# Altium project peripheral.PRJPCB
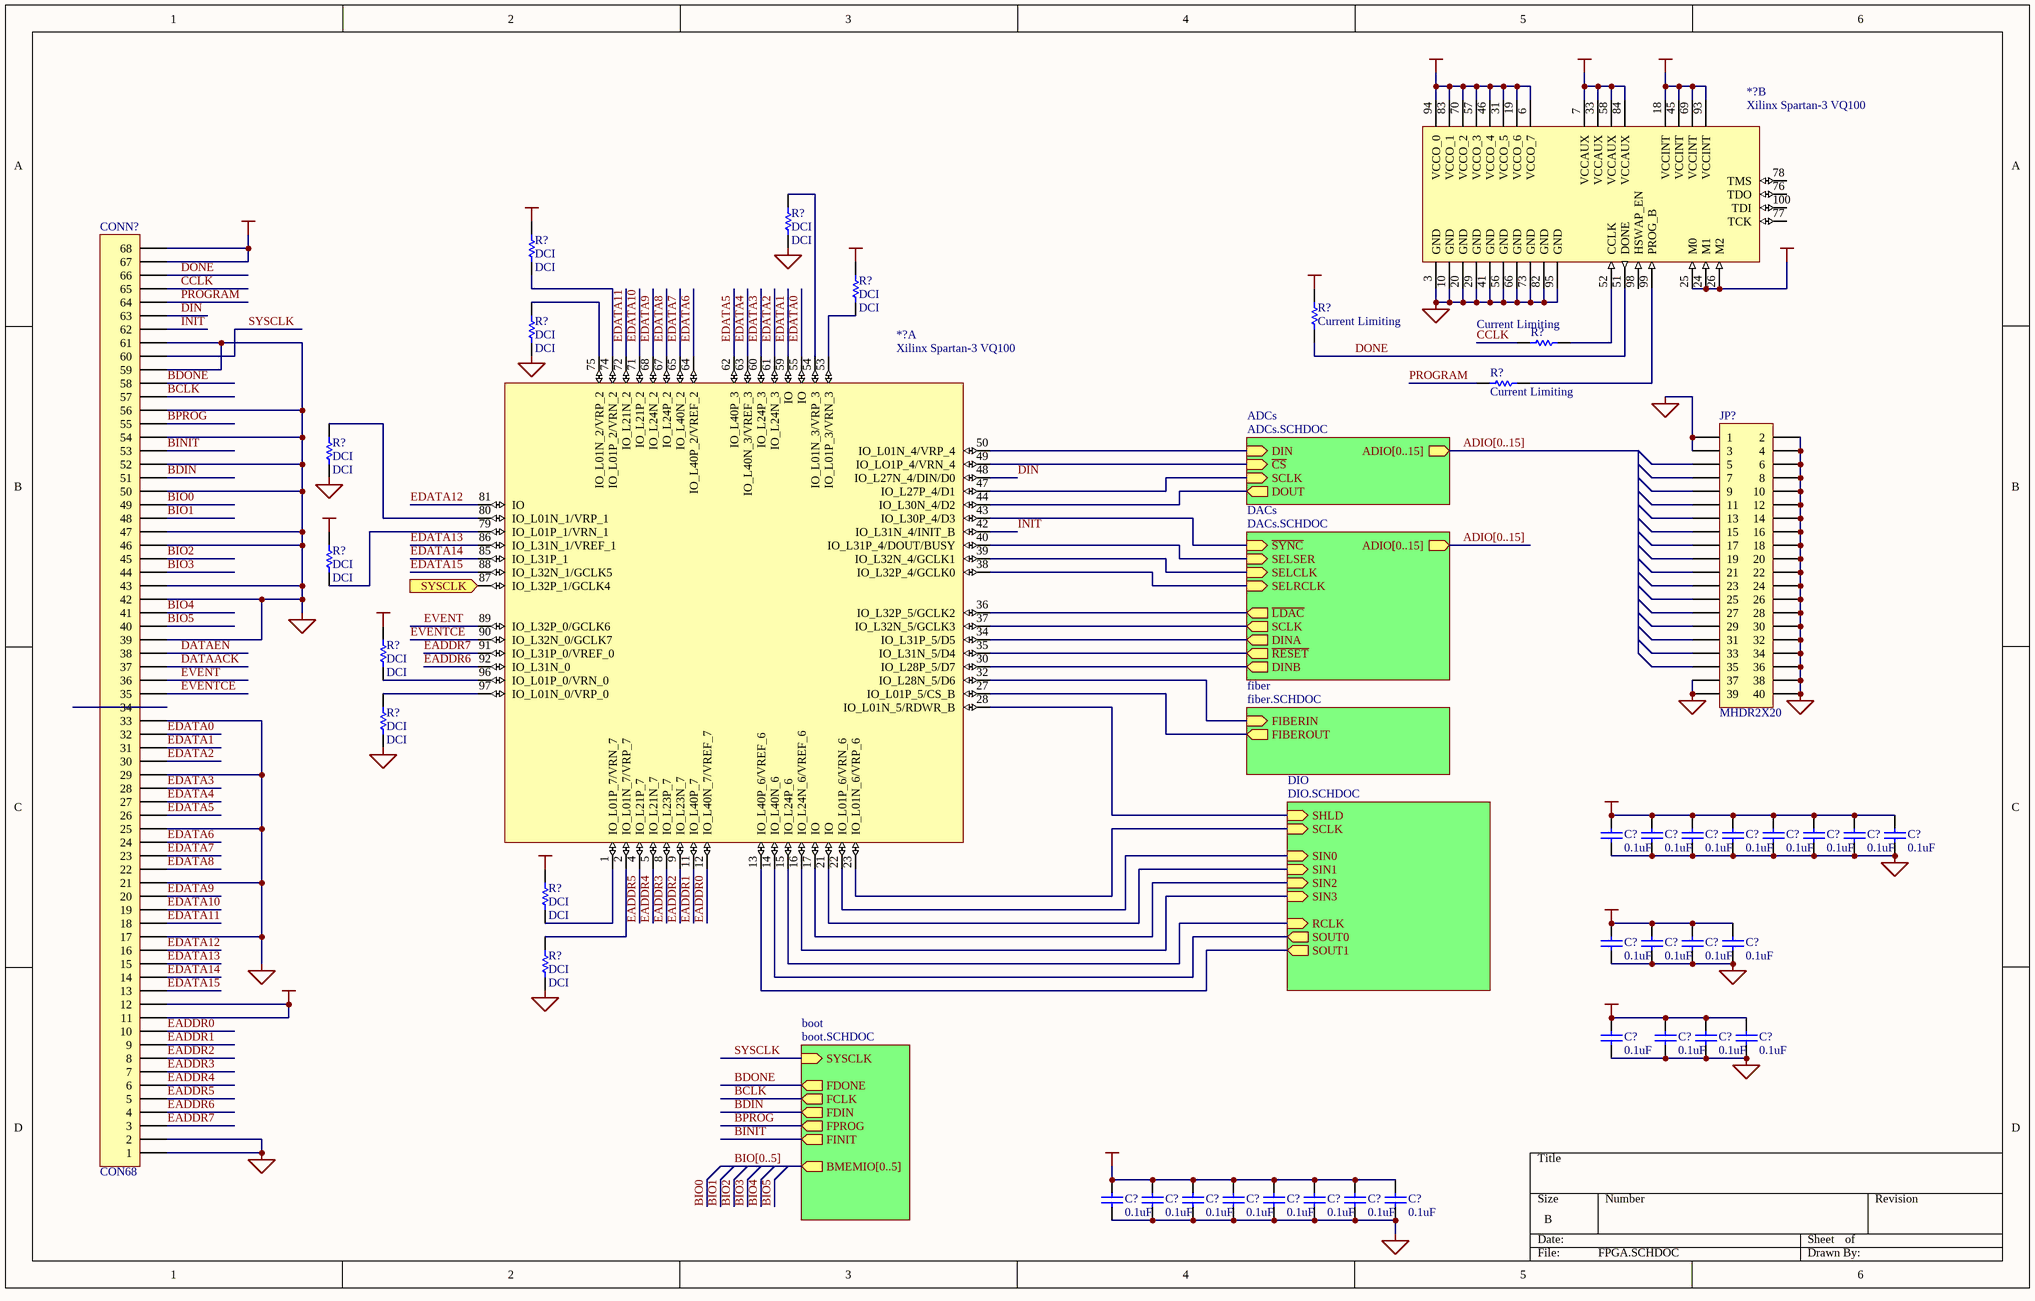
[diagram p0: FPGA.SCHDOC]
6 sheets, 193 parts. Net scope: hierarchical (ports join the sheet entries above them; power ports are global).
Sheets:
  FPGA.SCHDOC
    ADCs = ADCs.SCHDOC
    DIO = DIO.SCHDOC
    DACs = DACs.SCHDOC
    fiber = fiber.SCHDOC
    boot = boot.SCHDOC

## Sheet FPGA.SCHDOC
size B

### Parts
(Parts that share a designator on the sheet are numbered #1, #2 ... from top to bottom, then left to right.)
*?#1  Xilinx Spartan-3 VQ100  [F-QFP14X14-G100/N]  (part B of 2)
*?#2  Xilinx Spartan-3 VQ100  [F-QFP14X14-G100/N]  (part A of 2)
C?#1  value 0.1uF  [CC1608-0603]  (hidden comment: Cap)
C?#2  value 0.1uF  [CC1608-0603]  (hidden comment: Cap)
C?#3  value 0.1uF  [CC1608-0603]  (hidden comment: Cap)
C?#4  value 0.1uF  [CC1608-0603]  (hidden comment: Cap)
C?#5  value 0.1uF  [CC1608-0603]  (hidden comment: Cap)
C?#6  value 0.1uF  [CC1608-0603]  (hidden comment: Cap)
C?#7  value 0.1uF  [CC1608-0603]  (hidden comment: Cap)
C?#8  value 0.1uF  [CC1608-0603]  (hidden comment: Cap)
C?#9  value 0.1uF  [CC1608-0603]  (hidden comment: Cap)
C?#10  value 0.1uF  [CC1608-0603]  (hidden comment: Cap)
C?#11  value 0.1uF  [CC1608-0603]  (hidden comment: Cap)
C?#12  value 0.1uF  [CC1608-0603]  (hidden comment: Cap)
C?#13  value 0.1uF  [CC1608-0603]  (hidden comment: Cap)
C?#14  value 0.1uF  [CC1608-0603]  (hidden comment: Cap)
C?#15  value 0.1uF  [CC1608-0603]  (hidden comment: Cap)
C?#16  value 0.1uF  [CC1608-0603]  (hidden comment: Cap)
C?#17  value 0.1uF  [CC1608-0603]  (hidden comment: Cap)
C?#18  value 0.1uF  [CC1608-0603]  (hidden comment: Cap)
C?#19  value 0.1uF  [CC1608-0603]  (hidden comment: Cap)
C?#20  value 0.1uF  [CC1608-0603]  (hidden comment: Cap)
C?#21  value 0.1uF  [CC1608-0603]  (hidden comment: Cap)
C?#22  value 0.1uF  [CC1608-0603]  (hidden comment: Cap)
C?#23  value 0.1uF  [CC1608-0603]  (hidden comment: Cap)
C?#24  value 0.1uF  [CC1608-0603]  (hidden comment: Cap)
CONN?  CON68  [MOLEX 71661-2068]
JP?  MHDR2X20  [MHDR2X20]
R?#1  DCI  [CC1608-0603]
R?#2  DCI  [CC1608-0603]
R?#3  DCI  [CC1608-0603]
R?#4  Current Limiting  [CC1608-0603]
R?#5  Current Limiting  [CC1608-0603]
R?#6  DCI  [CC1608-0603]
R?#7  Current Limiting  [CC1608-0603]
R?#8  DCI  [CC1608-0603]
R?#9  DCI  [CC1608-0603]
R?#10  DCI  [CC1608-0603]
R?#11  DCI  [CC1608-0603]
R?#12  DCI  [CC1608-0603]
R?#13  DCI  [CC1608-0603]

### Sub-sheets
ADCs = ADCs.SCHDOC: ADIO[0..15] (out), DIN (in), DOUT (out), ~{CS} (in), SCLK (in)
boot = boot.SCHDOC: SYSCLK (in), BMEMIO[0..5] (out), FPROG (out), FDONE (out), FCLK (out), FDIN (out), FINIT (out)
DACs = DACs.SCHDOC: ADIO[0..15] (out), ~{SYNC} (in), ~{LDAC} (out), SCLK (out), DINA (out), ~{RESET} (out), DINB (out), SELSER (in), SELCLK (in), SELRCLK (in)
DIO = DIO.SCHDOC: SOUT0 (out), SOUT1 (out), SHLD (in), SCLK (in), SIN0 (in), SIN1 (in), SIN2 (in), SIN3 (in), RCLK (in)
fiber = fiber.SCHDOC: FIBERIN (in), FIBEROUT (out)

### Ports
SYSCLK (in)

### Nets
+1.2VCC: *?#1.18(VCCINT) *?#1.45(VCCINT) *?#1.69(VCCINT) *?#1.93(VCCINT) C?#9.1 C?#10.1 C?#11.1 C?#12.1
+2.5VCC: *?#1.7(VCCAUX) *?#1.33(VCCAUX) *?#1.58(VCCAUX) *?#1.84(VCCAUX) C?#13.1 C?#14.1 C?#15.1 C?#16.1
+3.3VCC: *?#1.6(VCCO_7) *?#1.19(VCCO_6) *?#1.31(VCCO_5) *?#1.46(VCCO_4) *?#1.57(VCCO_3) *?#1.70(VCCO_2) *?#1.83(VCCO_1) *?#1.94(VCCO_0)
+5VCC: C?#17.2 C?#18.2 C?#19.2 C?#20.2 C?#21.2 C?#22.2 C?#23.2 C?#24.2
GND: *?#1.3(GND) *?#1.10(GND) *?#1.20(GND) *?#1.29(GND) *?#1.41(GND) *?#1.56(GND) *?#1.66(GND) *?#1.73(GND) *?#1.82(GND) *?#1.95(GND) C?#1.2 C?#2.2 C?#3.2 C?#4.2 C?#5.2 C?#6.2 C?#7.2 C?#8.2 C?#9.2 C?#10.2 C?#11.2 C?#12.2 C?#13.2 C?#14.2 C?#15.2 C?#16.2 C?#17.1 C?#18.1 C?#19.1 C?#20.1 C?#21.1 C?#22.1 C?#23.1 C?#24.1 CONN?.1 CONN?.2 CONN?.17 CONN?.21 CONN?.25 CONN?.29 CONN?.33 CONN?.39 CONN?.42 CONN?.43 CONN?.46 CONN?.47 CONN?.50 CONN?.52 CONN?.54 CONN?.56 CONN?.59 CONN?.61 JP?.1 JP?.2 JP?.3 JP?.4 JP?.6 JP?.8 JP?.10 JP?.12 JP?.14 JP?.16 JP?.18 JP?.20 JP?.22 JP?.24 JP?.26 JP?.28 JP?.30 JP?.32 JP?.34 JP?.36 JP?.37 JP?.38 JP?.39 JP?.40 R?#1.1 R?#6.1 R?#8.1 R?#11.1 R?#13.1
VCC: *?#1.24(M1) *?#1.25(M0) *?#1.26(M2) C?#1.1 C?#2.1 C?#3.1 C?#4.1 C?#5.1 C?#6.1 C?#7.1 C?#8.1 CONN?.11 CONN?.12 CONN?.67 CONN?.68 R?#2.2 R?#3.2 R?#4.2 R?#9.2 R?#10.2 R?#12.2
BCLK: CONN?.57 ; sheet boot/FCLK
BDIN: CONN?.51 ; sheet boot/FDIN
BDONE: CONN?.58 ; sheet boot/FDONE
BINIT: CONN?.53 ; sheet boot/FINIT
BIO0: CONN?.49
BIO1: CONN?.48
BIO2: CONN?.45
BIO3: CONN?.44
BIO4: CONN?.41
BIO5: CONN?.40
BPROG: CONN?.55 ; sheet boot/FPROG
CCLK: CONN?.65 R?#5.1
DATAACK: CONN?.37
DATAEN: CONN?.38
DIN: *?#2.48(IO_L27N_4/DIN/D0) CONN?.63
DONE: *?#1.51(DONE) CONN?.66 R?#4.1
EADDR0: *?#2.12(IO_L40N_7/VREF_7) CONN?.10
EADDR1: *?#2.11(IO_L40P_7) CONN?.9
EADDR2: *?#2.9(IO_L23N_7) CONN?.8
EADDR3: *?#2.8(IO_L23P_7) CONN?.7
EADDR4: *?#2.5(IO_L21N_7) CONN?.6
EADDR5: *?#2.4(IO_L21P_7) CONN?.5
EADDR6: *?#2.92(IO_L31N_0) CONN?.4
EADDR7: *?#2.91(IO_L31P_0/VREF_0) CONN?.3
EDATA0: *?#2.55(IO) CONN?.32
EDATA1: *?#2.59(IO) CONN?.31
EDATA2: *?#2.61(IO_L24N_3) CONN?.30
EDATA3: *?#2.60(IO_L24P_3) CONN?.28
EDATA4: *?#2.63(IO_L40N_3/VREF_3) CONN?.27
EDATA5: *?#2.62(IO_L40P_3) CONN?.26
EDATA6: *?#2.64(IO_L40P_2/VREF_2) CONN?.24
EDATA7: *?#2.65(IO_L40N_2) CONN?.23
EDATA8: *?#2.67(IO_L24P_2) CONN?.22
EDATA9: *?#2.68(IO_L24N_2) CONN?.20
EDATA10: *?#2.71(IO_L21P_2) CONN?.19
EDATA11: *?#2.72(IO_L21N_2) CONN?.18
EDATA12: *?#2.81(IO) CONN?.16
EDATA13: *?#2.86(IO_L31N_1/VREF_1) CONN?.15
EDATA14: *?#2.85(IO_L31P_1) CONN?.14
EDATA15: *?#2.88(IO_L32N_1/GCLK5) CONN?.13
EVENT: *?#2.89(IO_L32P_0/GCLK6) CONN?.36
EVENTCE: *?#2.90(IO_L32N_0/GCLK7) CONN?.35
INIT: *?#2.42(IO_L31N_4/INIT_B) CONN?.62
~{LDAC}: *?#2.36(IO_L32P_5/GCLK2) ; sheet DACs/~{LDAC}
~{PROGRAM}: CONN?.64
PROGRAM: R?#7.1
~{RESET}: *?#2.35(IO_L31N_5/D4) ; sheet DACs/~{RESET}
RCLK: *?#2.15(IO_L24P_6) ; sheet DIO/RCLK
~{SYNC}: *?#2.43(IO_L30P_4/D3) ; sheet DACs/~{SYNC}
SCLK: *?#2.37(IO_L32N_5/GCLK3) ; sheet DACs/SCLK
SCLK: *?#2.23(IO_L01N_6/VRP_6) ; sheet DIO/SCLK  [a separate net that carries the same name]
SELCLK: *?#2.39(IO_L32N_4/GCLK1) ; sheet DACs/SELCLK
SELRCLK: *?#2.38(IO_L32P_4/GCLK0) ; sheet DACs/SELRCLK
SELSER: *?#2.40(IO_L31P_4/DOUT/BUSY) ; sheet DACs/SELSER
SHLD: *?#2.28(IO_L01N_5/RDWR_B) ; sheet DIO/SHLD
SYSCLK: CONN?.60 ; sheet boot/SYSCLK
Net*?#1_52: *?#1.52(CCLK) R?#5.2
Net*?#1_99: *?#1.99(PROG_B) R?#7.2
Net*?#2_1: *?#2.1(IO_L01P_7/VRN_7) R?#12.1
Net*?#2_2: *?#2.2(IO_L01N_7/VRP_7) R?#13.2
Net*?#2_13: *?#2.13(IO_L40P_6/VREF_6) ; sheet DIO/SOUT1
Net*?#2_14: *?#2.14(IO_L40N_6) ; sheet DIO/SOUT0
Net*?#2_16: *?#2.16(IO_L24N_6/VREF_6) ; sheet DIO/SIN3
Net*?#2_17: *?#2.17(IO) ; sheet DIO/SIN2
Net*?#2_21: *?#2.21(IO) ; sheet DIO/SIN1
Net*?#2_22: *?#2.22(IO_L01P_6/VRN_6) ; sheet DIO/SIN0
Net*?#2_27: *?#2.27(IO_L01P_5/CS_B) ; sheet fiber/FIBEROUT
Net*?#2_30: *?#2.30(IO_L28P_5/D7) ; sheet DACs/DINB
Net*?#2_32: *?#2.32(IO_L28N_5/D6) ; sheet fiber/FIBERIN
Net*?#2_34: *?#2.34(IO_L31P_5/D5) ; sheet DACs/DINA
Net*?#2_44: *?#2.44(IO_L30N_4/D2) ; sheet ADCs/DOUT
Net*?#2_47: *?#2.47(IO_L27P_4/D1) ; sheet ADCs/SCLK
Net*?#2_49: *?#2.49(IO_LO1P_4/VRN_4) ; sheet ADCs/~{CS}
Net*?#2_50: *?#2.50(IO_L01N_4/VRP_4) ; sheet ADCs/DIN
Net*?#2_53: *?#2.53(IO_L01P_3/VRN_3) R?#3.1
Net*?#2_54: *?#2.54(IO_L01N_3/VRP_3) R?#1.2
Net*?#2_74: *?#2.74(IO_L01P_2/VRN_2) R?#2.1
Net*?#2_75: *?#2.75(IO_L01N_2/VRP_2) R?#6.2
Net*?#2_79: *?#2.79(IO_L01P_1/VRN_1) R?#9.1
Net*?#2_80: *?#2.80(IO_L01N_1/VRP_1) R?#8.2
Net*?#2_87: *?#2.87(IO_L32P_1/GCLK4) ; port SYSCLK
Net*?#2_96: *?#2.96(IO_L01P_0/VRN_0) R?#10.1
Net*?#2_97: *?#2.97(IO_L01N_0/VRP_0) R?#11.2

Not connected (* = marked no-connect by the designer): *?#1 76(TDO) 77(TCK) 78(TMS) 98(HSWAP_EN) 100(TDI); CONN? 34; JP? 5 7 9 11 13 15 17 19 21 23 25 27 29 31 33 35

### Buses and harness runs
bus ADIO[0..15] = sheet ADCs/ADIO[0..15]
bus ADIO[0..15] = sheet DACs/ADIO[0..15]
bus BIO[0..5] = sheet boot/BMEMIO[0..5]

### Library data of the parts
*?#1 *?#2 = XC3S50-VQ100
C?#1-C?#24 = Cap: Capacitor; Manufacturer: Generic Components; Class I: Passive; Published: 8-Jun-2000; Revision: July-2002: Re-released for DXP Platform.; Publisher: Altium Limited; Class II: Capacitor
JP? = MHDR2X20: Header, 20-Pin, Dual row; Manufacturer: Generic Components; Class I: Connector; Revision: July-2002: Re-released for DXP Platform.; Publisher: Altium Limited
R?#1-R?#3 R?#6 R?#8-R?#13 = Res1: Resistor; Manufacturer: Generic Components; Class I: Passive; Published: 8-Jun-2000; Revision: July-2002: Re-released for DXP Platform.; Publisher: Altium Limited; Class II: Resistor; Value: DCI
R?#4 R?#5 R?#7 = Res1: Resistor; Manufacturer: Generic Components; Class I: Passive; Value: 1K; Published: 8-Jun-2000; Revision: July-2002: Re-released for DXP Platform.; Publisher: Altium Limited; Class II: Resistor

## Sheet ADCs.SCHDOC
size B
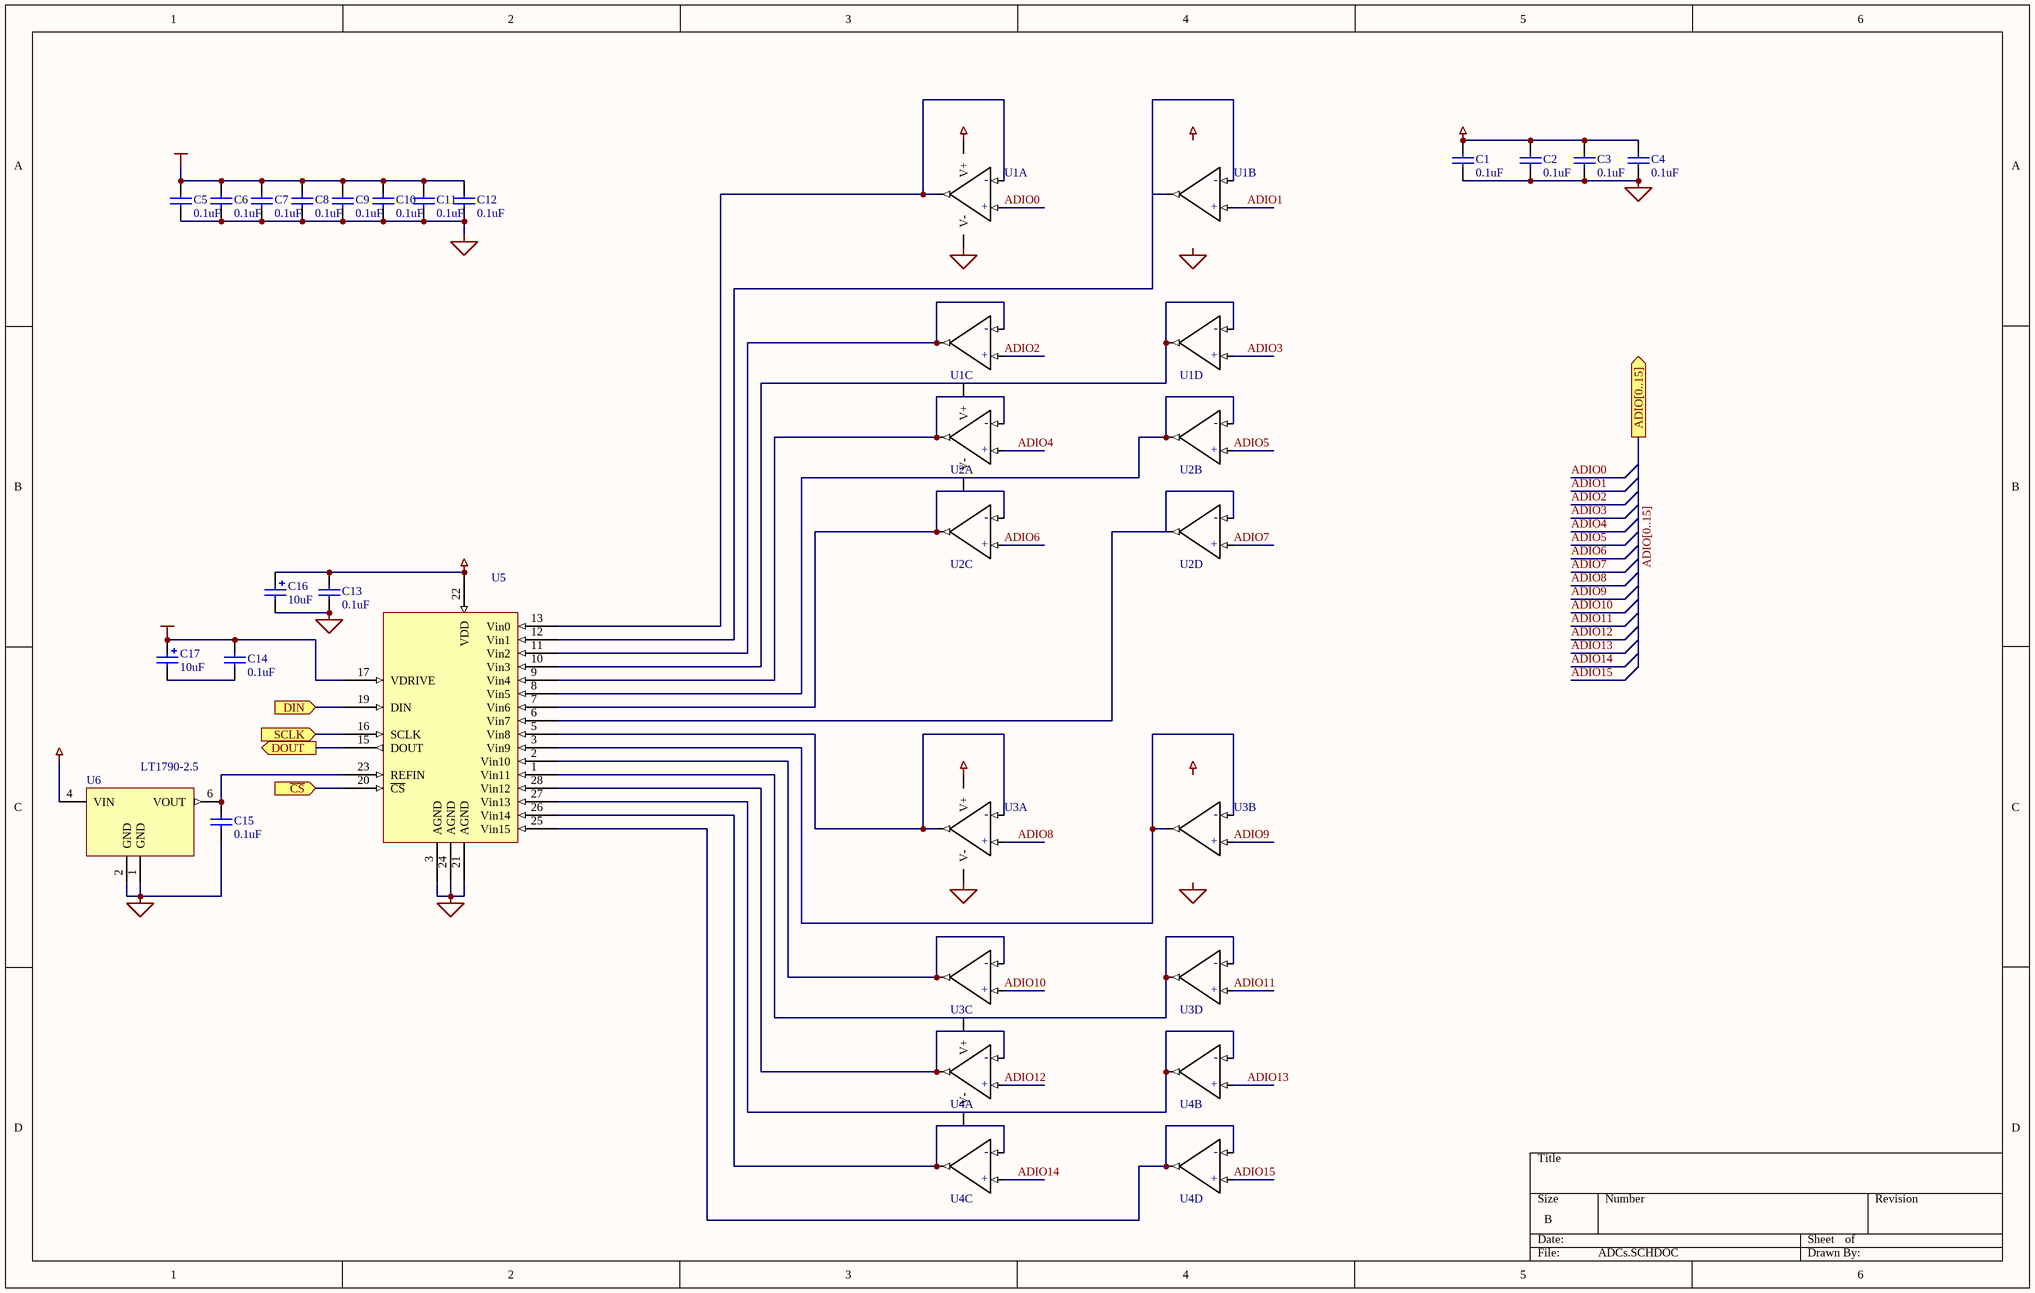
[diagram p1: ADCs.SCHDOC]

### Parts
(Parts that share a designator on the sheet are numbered #1, #2 ... from top to bottom, then left to right.)
C1  value 0.1uF  [CC1608-0603]  (hidden comment: Cap)
C2  value 0.1uF  [CC1608-0603]  (hidden comment: Cap)
C3  value 0.1uF  [CC1608-0603]  (hidden comment: Cap)
C4  value 0.1uF  [CC1608-0603]  (hidden comment: Cap)
C5  value 0.1uF  [CC1608-0603]  (hidden comment: Cap)
C6#1  value 0.1uF  [CC1608-0603]  (hidden comment: Cap)
C7  value 0.1uF  [CC1608-0603]  (hidden comment: Cap)
C8  value 0.1uF  [CC1608-0603]  (hidden comment: Cap)
C9  value 0.1uF  [CC1608-0603]  (hidden comment: Cap)
C10  value 0.1uF  [CC1608-0603]  (hidden comment: Cap)
C11  value 0.1uF  [CC1608-0603]  (hidden comment: Cap)
C12#1  value 0.1uF  [CC1608-0603]  (hidden comment: Cap)
C13#1  value 0.1uF  [CC1608-0603]  (hidden comment: Cap)
C14#1  value 0.1uF  [CC1608-0603]  (hidden comment: Cap)
C15  value 0.1uF  [CC1608-0603]  (hidden comment: Cap)
C16  value 10uF  [TC3528-1411]  (hidden comment: Tantalum)
C17  value 10uF  [TC3528-1411]  (hidden comment: Tantalum)
U1  OP496  [SO-G14]  (value not drawn)  (parts A,B,C,D of 4)
U2#1  OP496  [SO-G14]  (value not drawn)  (parts A,B,C,D of 4)
U3  OP496  [SO-G14]  (value not drawn)  (parts A,B,C,D of 4)
U4#1  OP496  [SO-G14]  (value not drawn)  (parts A,B,C,D of 4)
U5  (no value)  [SSO-G28/X.45]
U6  LT1790-2.5  [LTI SOT-23 ThinSOT]

### Ports
ADIO[0..15] (out), DIN (in), DOUT (out), SCLK (in), ~{CS} (in)

### Nets
+5VCC: C5.2 C6#1.2 C7.2 C8.2 C9.2 C10.2 C11.2 C12#1.2
AVDD: C1.2 C2.2 C3.2 C4.2 C13#1.2 C16.1 U1.4(V+) U3.4(V+) U5.22(VDD) U6.4(VIN)
GND: C1.1 C2.1 C3.1 C4.1 C5.1 C6#1.1 C7.1 C8.1 C9.1 C10.1 C11.1 C12#1.1 C13#1.1 C15.2 C16.2 U5.3(AGND) U5.21(AGND) U5.24(AGND) U6.1(GND) U6.2(GND)
SGND: U1.11(V-) U3.11(V-)
VCC: C14#1.2 C17.1 U5.17(VDRIVE)
ADIO0: U1.3(+INA)
ADIO1: U1.5(+INB)
ADIO2: U1.10(+INC)
ADIO3: U1.12(+IND)
ADIO4: U2#1.3(+INA)
ADIO5: U2#1.5(+INB)
ADIO6: U2#1.10(+INC)
ADIO7: U2#1.12(+IND)
ADIO8: U3.3(+INA)
ADIO9: U3.5(+INB)
ADIO10: U3.10(+INC)
ADIO11: U3.12(+IND)
ADIO12: U4#1.3(+INA)
ADIO13: U4#1.5(+INB)
ADIO14: U4#1.10(+INC)
ADIO15: U4#1.12(+IND)
Net*?#2_44: U5.15(DOUT) ; port DOUT
Net*?#2_47: U5.16(SCLK) ; port SCLK
Net*?#2_49: U5.20(~{CS}) ; port ~{CS}
Net*?#2_50: U5.19(DIN) ; port DIN
NetC14#1_1: C14#1.1 C17.2
NetC15_1: C15.1 U5.23(REFIN) U6.6(VOUT)
NetU1_1: U1.1(OUTA) U1.2(-INA) U5.13(Vin0)
NetU1_6: U1.6(-INB) U1.7(OUTB) U5.12(Vin1)
NetU1_8: U1.8(OUTC) U1.9(-INC) U5.11(Vin2)
NetU1_13: U1.13(-IND) U1.14(OUTD) U2#1.4(V+) U5.10(Vin3)
NetU2#1_1: U2#1.1(OUTA) U2#1.2(-INA) U5.9(Vin4)
NetU2#1_6: U2#1.6(-INB) U2#1.7(OUTB) U5.8(Vin5)
NetU2#1_8: U2#1.8(OUTC) U2#1.9(-INC) U2#1.11(V-) U5.7(Vin6)
NetU2#1_13: U2#1.13(-IND) U2#1.14(OUTD) U5.6(Vin7)
NetU3_1: U3.1(OUTA) U3.2(-INA) U5.5(Vin8)
NetU3_6: U3.6(-INB) U3.7(OUTB) U5.3(Vin9)
NetU3_8: U3.8(OUTC) U3.9(-INC) U5.2(Vin10)
NetU3_13: U3.13(-IND) U3.14(OUTD) U4#1.4(V+) U5.1(Vin11)
NetU4#1_1: U4#1.1(OUTA) U4#1.2(-INA) U5.28(Vin12)
NetU4#1_6: U4#1.6(-INB) U4#1.7(OUTB) U5.27(Vin13)
NetU4#1_8: U4#1.8(OUTC) U4#1.9(-INC) U4#1.11(V-) U5.26(Vin14)
NetU4#1_13: U4#1.13(-IND) U4#1.14(OUTD) U5.25(Vin15)

### Buses and harness runs
bus ADIO[0..15] = port ADIO[0..15]

### Notes on the sheet
- Labels drawn without touching a wire or pin: AVDD, SGND
- (in symbol OP496, part A) -; +
- (in symbol OP496, part B) -; +
- (in symbol OP496, part C) -; +
- (in symbol OP496, part D) -; +

### Library data of the parts
C1-C5 C6#1 C7-C11 C12#1 C13#1 C14#1 C15 = Cap: as C?#1 on sheet FPGA; Published: 8-Jun-2000; Revision: July-2002: Re-released for DXP Platform.; Publisher: Altium Limited; Class II: Capacitor
C16 C17 = Cap Pol1: Polarized Capacitor (Radial); Manufacturer: Generic Components; Class I: Passive; Published: 8-Jun-2000; Revision: July-2002: Re-released for DXP Platform.; Publisher: Altium Limited; Class II: Capacitor
U1 U2#1 U3 U4#1 = OP496: AD quad RRIO OA
U5 = AD7490BRU: AD 16-chan 12-bit ADC
U6 = LT1790: Micropower SOT-23 Low Dropout Reference Family

## Sheet DIO.SCHDOC
size B
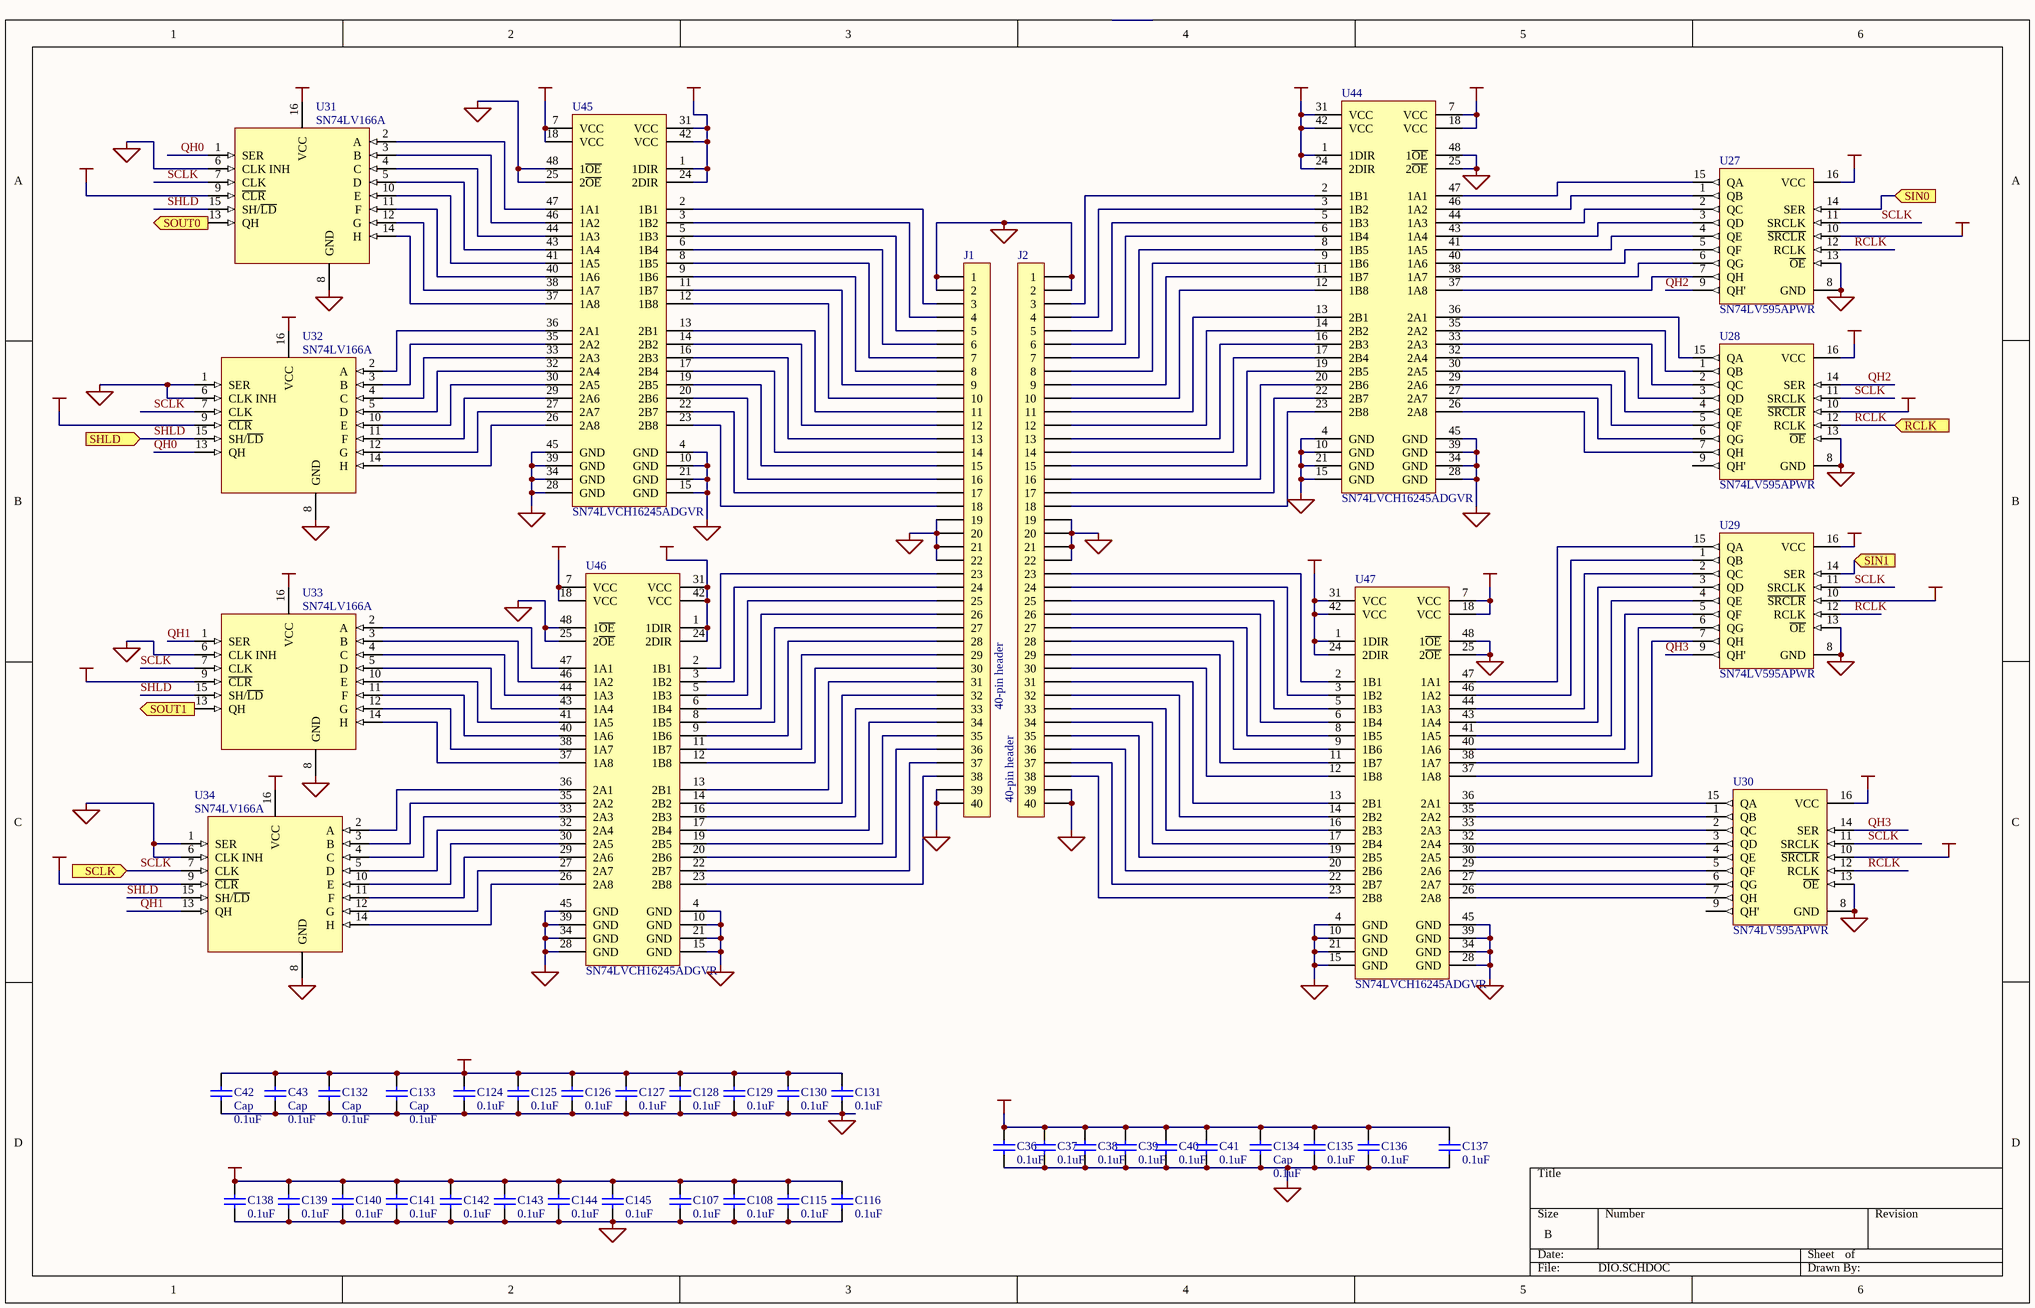
[diagram p2: DIO.SCHDOC]

### Parts
(Parts that share a designator on the sheet are numbered #1, #2 ... from top to bottom, then left to right.)
C36  value 0.1uF  [CC1608-0603]  (hidden comment: Cap)
C37  value 0.1uF  [CC1608-0603]  (hidden comment: Cap)
C38  value 0.1uF  [CC1608-0603]  (hidden comment: Cap)
C39  value 0.1uF  [CC1608-0603]  (hidden comment: Cap)
C40#1  value 0.1uF  [CC1608-0603]  (hidden comment: Cap)
C41  value 0.1uF  [CC1608-0603]  (hidden comment: Cap)
C42  Cap  value 0.1uF  [CC1608-0603]
C43  Cap  value 0.1uF  [CC1608-0603]
C107  value 0.1uF  [CC1608-0603]  (hidden comment: Cap)
C108  value 0.1uF  [CC1608-0603]  (hidden comment: Cap)
C115  value 0.1uF  [CC1608-0603]  (hidden comment: Cap)
C116  value 0.1uF  [CC1608-0603]  (hidden comment: Cap)
C124  value 0.1uF  [CC1608-0603]  (hidden comment: Cap)
C125  value 0.1uF  [CC1608-0603]  (hidden comment: Cap)
C126  value 0.1uF  [CC1608-0603]  (hidden comment: Cap)
C127  value 0.1uF  [CC1608-0603]  (hidden comment: Cap)
C128  value 0.1uF  [CC1608-0603]  (hidden comment: Cap)
C129  value 0.1uF  [CC1608-0603]  (hidden comment: Cap)
C130  value 0.1uF  [CC1608-0603]  (hidden comment: Cap)
C131  value 0.1uF  [CC1608-0603]  (hidden comment: Cap)
C132  Cap  value 0.1uF  [CC1608-0603]
C133  Cap  value 0.1uF  [CC1608-0603]
C134  Cap  value 0.1uF  [CC1608-0603]
C135  value 0.1uF  [CC1608-0603]  (hidden comment: Cap)
C136  value 0.1uF  [CC1608-0603]  (hidden comment: Cap)
C137  value 0.1uF  [CC1608-0603]  (hidden comment: Cap)
C138  value 0.1uF  [CC1608-0603]  (hidden comment: Cap)
C139  value 0.1uF  [CC1608-0603]  (hidden comment: Cap)
C140  value 0.1uF  [CC1608-0603]  (hidden comment: Cap)
C141  value 0.1uF  [CC1608-0603]  (hidden comment: Cap)
C142  value 0.1uF  [CC1608-0603]  (hidden comment: Cap)
C143  value 0.1uF  [CC1608-0603]  (hidden comment: Cap)
C144  value 0.1uF  [CC1608-0603]  (hidden comment: Cap)
C145  value 0.1uF  [CC1608-0603]  (hidden comment: Cap)
J1  40-pin header  [HDR2X20]
J2  40-pin header  [HDR2X20]
U27  SN74LV595APWR  [SSO-G16/X.4]
U28  SN74LV595APWR  [SSO-G16/X.4]
U29  SN74LV595APWR  [SSO-G16/X.4]
U30  SN74LV595APWR  [SSO-G16/X.4]
U31  SN74LV166A  [SSO-G16/X.4]
U32  SN74LV166A  [SSO-G16/X.4]
U33  SN74LV166A  [SSO-G16/X.4]
U34  SN74LV166A  [SSO-G16/X.4]
U44  SN74LVCH16245ADGVR  [TSSO10X6-G48-0.4]
U45  SN74LVCH16245ADGVR  [TSSO10X6-G48-0.4]
U46  SN74LVCH16245ADGVR  [TSSO10X6-G48-0.4]
U47  SN74LVCH16245ADGVR  [TSSO10X6-G48-0.4]

### Ports
RCLK (in), SCLK (in), SHLD (in), SIN0 (in), SIN1 (in), SOUT0 (out), SOUT1 (out)

### Nets
+5VCC: C36.2 C37.2 C38.2 C39.2 C40#1.2 C41.2 C134.2 C135.2 C136.2 C137.1 U44.7(VCC) U44.18(VCC) U45.7(VCC) U45.18(VCC) U46.7(VCC) U46.18(VCC) U47.7(VCC) U47.18(VCC)
GND: C36.1 C37.1 C38.1 C39.1 C40#1.1 C41.1 C42.2 C43.2 C107.1 C108.1 C115.1 C116.1 C124.1 C125.1 C126.1 C127.1 C128.1 C129.1 C130.1 C131.1 C132.2 C133.2 C134.1 C135.1 C136.1 C137.2 C138.1 C139.1 C140.1 C141.1 C142.1 C143.1 C144.1 C145.1 J1.1 J1.2 J1.19 J1.20 J1.21 J1.22 J1.39 J1.40 J2.1 J2.2 J2.19 J2.20 J2.21 J2.22 J2.39 J2.40 U27.8(GND) U27.13(~{OE}) U28.8(GND) U28.13(~{OE}) U29.8(GND) U29.13(~{OE}) U30.8(GND) U30.13(~{OE}) U31.6(CLK_INH) U31.8(GND) U32.1(SER) U32.6(CLK_INH) U32.8(GND) U33.6(CLK_INH) U33.8(GND) U34.1(SER) U34.6(CLK_INH) U34.8(GND) U44.4(GND) U44.10(GND) U44.15(GND) U44.21(GND) U44.25(2~{OE}) U44.28(GND) U44.34(GND) U44.39(GND) U44.45(GND) U44.48(1~{OE}) U45.4(GND) U45.10(GND) U45.15(GND) U45.21(GND) U45.25(2~{OE}) U45.28(GND) U45.34(GND) U45.39(GND) U45.45(GND) U45.48(1~{OE}) U46.4(GND) U46.10(GND) U46.15(GND) U46.21(GND) U46.25(2~{OE}) U46.28(GND) U46.34(GND) U46.39(GND) U46.45(GND) U46.48(1~{OE}) U47.4(GND) U47.10(GND) U47.15(GND) U47.21(GND) U47.25(2~{OE}) U47.28(GND) U47.34(GND) U47.39(GND) U47.45(GND) U47.48(1~{OE})
VCC: C42.1 C43.1 C107.2 C108.2 C115.2 C116.2 C124.2 C125.2 C126.2 C127.2 C128.2 C129.2 C130.2 C131.2 C132.1 C133.1 C138.2 C139.2 C140.2 C141.2 C142.2 C143.2 C144.2 C145.2 U27.10(~{SRCLR}) U27.16(VCC) U28.10(~{SRCLR}) U28.16(VCC) U29.10(~{SRCLR}) U29.16(VCC) U30.10(~{SRCLR}) U30.16(VCC) U31.9(~{CLR}) U31.16(VCC) U32.9(~{CLR}) U32.16(VCC) U33.9(~{CLR}) U33.16(VCC) U34.9(~{CLR}) U34.16(VCC) U44.1(1DIR) U44.24(2DIR) U44.31(VCC) U44.42(VCC) U45.1(1DIR) U45.24(2DIR) U45.31(VCC) U45.42(VCC) U46.1(1DIR) U46.24(2DIR) U46.31(VCC) U46.42(VCC) U47.1(1DIR) U47.24(2DIR) U47.31(VCC) U47.42(VCC)
QH0: U31.1(SER) U32.13(QH)
QH1: U33.1(SER) U34.13(QH)
QH2: U27.9(QH') U28.14(SER)
QH3: U29.9(QH') U30.14(SER)
RCLK: U27.12(RCLK) U28.12(RCLK) U29.12(RCLK) U30.12(RCLK) ; port RCLK
SCLK: U27.11(SRCLK) U28.11(SRCLK) U29.11(SRCLK) U30.11(SRCLK) U31.7(CLK) U32.7(CLK) U33.7(CLK) U34.7(CLK) ; port SCLK
SHLD: U31.15(SH/~{LD}) U32.15(SH/~{LD}) U33.15(SH/~{LD}) U34.15(SH/~{LD}) ; port SHLD
Net*?#2_13: U33.13(QH) ; port SOUT1
Net*?#2_14: U31.13(QH) ; port SOUT0
Net*?#2_21: U29.14(SER) ; port SIN1
Net*?#2_22: U27.14(SER) ; port SIN0
NetJ1_3: J1.3 U45.2(1B1)
NetJ1_4: J1.4 U45.3(1B2)
NetJ1_5: J1.5 U45.5(1B3)
NetJ1_6: J1.6 U45.6(1B4)
NetJ1_7: J1.7 U45.8(1B5)
NetJ1_8: J1.8 U45.9(1B6)
NetJ1_9: J1.9 U45.11(1B7)
NetJ1_10: J1.10 U45.12(1B8)
NetJ1_11: J1.11 U45.13(2B1)
NetJ1_12: J1.12 U45.14(2B2)
NetJ1_13: J1.13 U45.16(2B3)
NetJ1_14: J1.14 U45.17(2B4)
NetJ1_15: J1.15 U45.19(2B5)
NetJ1_16: J1.16 U45.20(2B6)
NetJ1_17: J1.17 U45.22(2B7)
NetJ1_18: J1.18 U45.23(2B8)
NetJ1_23: J1.23 U46.2(1B1)
NetJ1_24: J1.24 U46.3(1B2)
NetJ1_25: J1.25 U46.5(1B3)
NetJ1_26: J1.26 U46.6(1B4)
NetJ1_27: J1.27 U46.8(1B5)
NetJ1_28: J1.28 U46.9(1B6)
NetJ1_29: J1.29 U46.11(1B7)
NetJ1_30: J1.30 U46.12(1B8)
NetJ1_31: J1.31 U46.13(2B1)
NetJ1_32: J1.32 U46.14(2B2)
NetJ1_33: J1.33 U46.16(2B3)
NetJ1_34: J1.34 U46.17(2B4)
NetJ1_35: J1.35 U46.19(2B5)
NetJ1_36: J1.36 U46.20(2B6)
NetJ1_37: J1.37 U46.22(2B7)
NetJ1_38: J1.38 U46.23(2B8)
NetJ2_3: J2.3 U44.2(1B1)
NetJ2_4: J2.4 U44.3(1B2)
NetJ2_5: J2.5 U44.5(1B3)
NetJ2_6: J2.6 U44.6(1B4)
NetJ2_7: J2.7 U44.8(1B5)
NetJ2_8: J2.8 U44.9(1B6)
NetJ2_9: J2.9 U44.11(1B7)
NetJ2_10: J2.10 U44.12(1B8)
NetJ2_11: J2.11 U44.13(2B1)
NetJ2_12: J2.12 U44.14(2B2)
NetJ2_13: J2.13 U44.16(2B3)
NetJ2_14: J2.14 U44.17(2B4)
NetJ2_15: J2.15 U44.19(2B5)
NetJ2_16: J2.16 U44.20(2B6)
NetJ2_17: J2.17 U44.22(2B7)
NetJ2_18: J2.18 U44.23(2B8)
NetJ2_23: J2.23 U47.2(1B1)
NetJ2_24: J2.24 U47.3(1B2)
NetJ2_25: J2.25 U47.5(1B3)
NetJ2_26: J2.26 U47.6(1B4)
NetJ2_27: J2.27 U47.8(1B5)
NetJ2_28: J2.28 U47.9(1B6)
NetJ2_29: J2.29 U47.11(1B7)
NetJ2_30: J2.30 U47.12(1B8)
NetJ2_31: J2.31 U47.13(2B1)
NetJ2_32: J2.32 U47.14(2B2)
NetJ2_33: J2.33 U47.16(2B3)
NetJ2_34: J2.34 U47.17(2B4)
NetJ2_35: J2.35 U47.19(2B5)
NetJ2_36: J2.36 U47.20(2B6)
NetJ2_37: J2.37 U47.22(2B7)
NetJ2_38: J2.38 U47.23(2B8)
NetU27_1: U27.1(QB) U44.46(1A2)
NetU27_2: U27.2(QC) U44.44(1A3)
NetU27_3: U27.3(QD) U44.43(1A4)
NetU27_4: U27.4(QE) U44.41(1A5)
NetU27_5: U27.5(QF) U44.40(1A6)
NetU27_6: U27.6(QG) U44.38(1A7)
NetU27_7: U27.7(QH) U44.37(1A8)
NetU27_15: U27.15(QA) U44.47(1A1)
NetU28_1: U28.1(QB) U44.35(2A2)
NetU28_2: U28.2(QC) U44.33(2A3)
NetU28_3: U28.3(QD) U44.32(2A4)
NetU28_4: U28.4(QE) U44.30(2A5)
NetU28_5: U28.5(QF) U44.29(2A6)
NetU28_6: U28.6(QG) U44.27(2A7)
NetU28_7: U28.7(QH) U44.26(2A8)
NetU28_15: U28.15(QA) U44.36(2A1)
NetU29_1: U29.1(QB) U47.46(1A2)
NetU29_2: U29.2(QC) U47.44(1A3)
NetU29_3: U29.3(QD) U47.43(1A4)
NetU29_4: U29.4(QE) U47.41(1A5)
NetU29_5: U29.5(QF) U47.40(1A6)
NetU29_6: U29.6(QG) U47.38(1A7)
NetU29_7: U29.7(QH) U47.37(1A8)
NetU29_15: U29.15(QA) U47.47(1A1)
NetU30_1: U30.1(QB) U47.35(2A2)
NetU30_2: U30.2(QC) U47.33(2A3)
NetU30_3: U30.3(QD) U47.32(2A4)
NetU30_4: U30.4(QE) U47.30(2A5)
NetU30_5: U30.5(QF) U47.29(2A6)
NetU30_6: U30.6(QG) U47.27(2A7)
NetU30_7: U30.7(QH) U47.26(2A8)
NetU30_15: U30.15(QA) U47.36(2A1)
NetU31_2: U31.2(A) U45.47(1A1)
NetU31_3: U31.3(B) U45.46(1A2)
NetU31_4: U31.4(C) U45.44(1A3)
NetU31_5: U31.5(D) U45.43(1A4)
NetU31_10: U31.10(E) U45.41(1A5)
NetU31_11: U31.11(F) U45.40(1A6)
NetU31_12: U31.12(G) U45.38(1A7)
NetU31_14: U31.14(H) U45.37(1A8)
NetU32_2: U32.2(A) U45.36(2A1)
NetU32_3: U32.3(B) U45.35(2A2)
NetU32_4: U32.4(C) U45.33(2A3)
NetU32_5: U32.5(D) U45.32(2A4)
NetU32_10: U32.10(E) U45.30(2A5)
NetU32_11: U32.11(F) U45.29(2A6)
NetU32_12: U32.12(G) U45.27(2A7)
NetU32_14: U32.14(H) U45.26(2A8)
NetU33_2: U33.2(A) U46.47(1A1)
NetU33_3: U33.3(B) U46.46(1A2)
NetU33_4: U33.4(C) U46.44(1A3)
NetU33_5: U33.5(D) U46.43(1A4)
NetU33_10: U33.10(E) U46.41(1A5)
NetU33_11: U33.11(F) U46.40(1A6)
NetU33_12: U33.12(G) U46.38(1A7)
NetU33_14: U33.14(H) U46.37(1A8)
NetU34_2: U34.2(A) U46.36(2A1)
NetU34_3: U34.3(B) U46.35(2A2)
NetU34_4: U34.4(C) U46.33(2A3)
NetU34_5: U34.5(D) U46.32(2A4)
NetU34_10: U34.10(E) U46.30(2A5)
NetU34_11: U34.11(F) U46.29(2A6)
NetU34_12: U34.12(G) U46.27(2A7)
NetU34_14: U34.14(H) U46.26(2A8)

Not connected (* = marked no-connect by the designer): U28 9(QH'); U30 9(QH')

### Library data of the parts
C36-C39 C40#1 C41-C43 C107 C108 C115 C116 C124-C145 = Cap: as C?#1 on sheet FPGA; Published: 8-Jun-2000; Revision: July-2002: Re-released for DXP Platform.; Publisher: Altium Limited; Class II: Capacitor
J1 J2 = 40PINHEADER: Simple 40pin connector
U27-U30 = SN74LV595APWR: 8-bit shift register with 3-state output
U31-U34 = SN74LV166APWR: 8-bit parallel-load shift register
U44-U47 = SN74LVCH16245A: 16-bit bus transceiver with 3-state outputs

## Sheet DACs.SCHDOC
size B
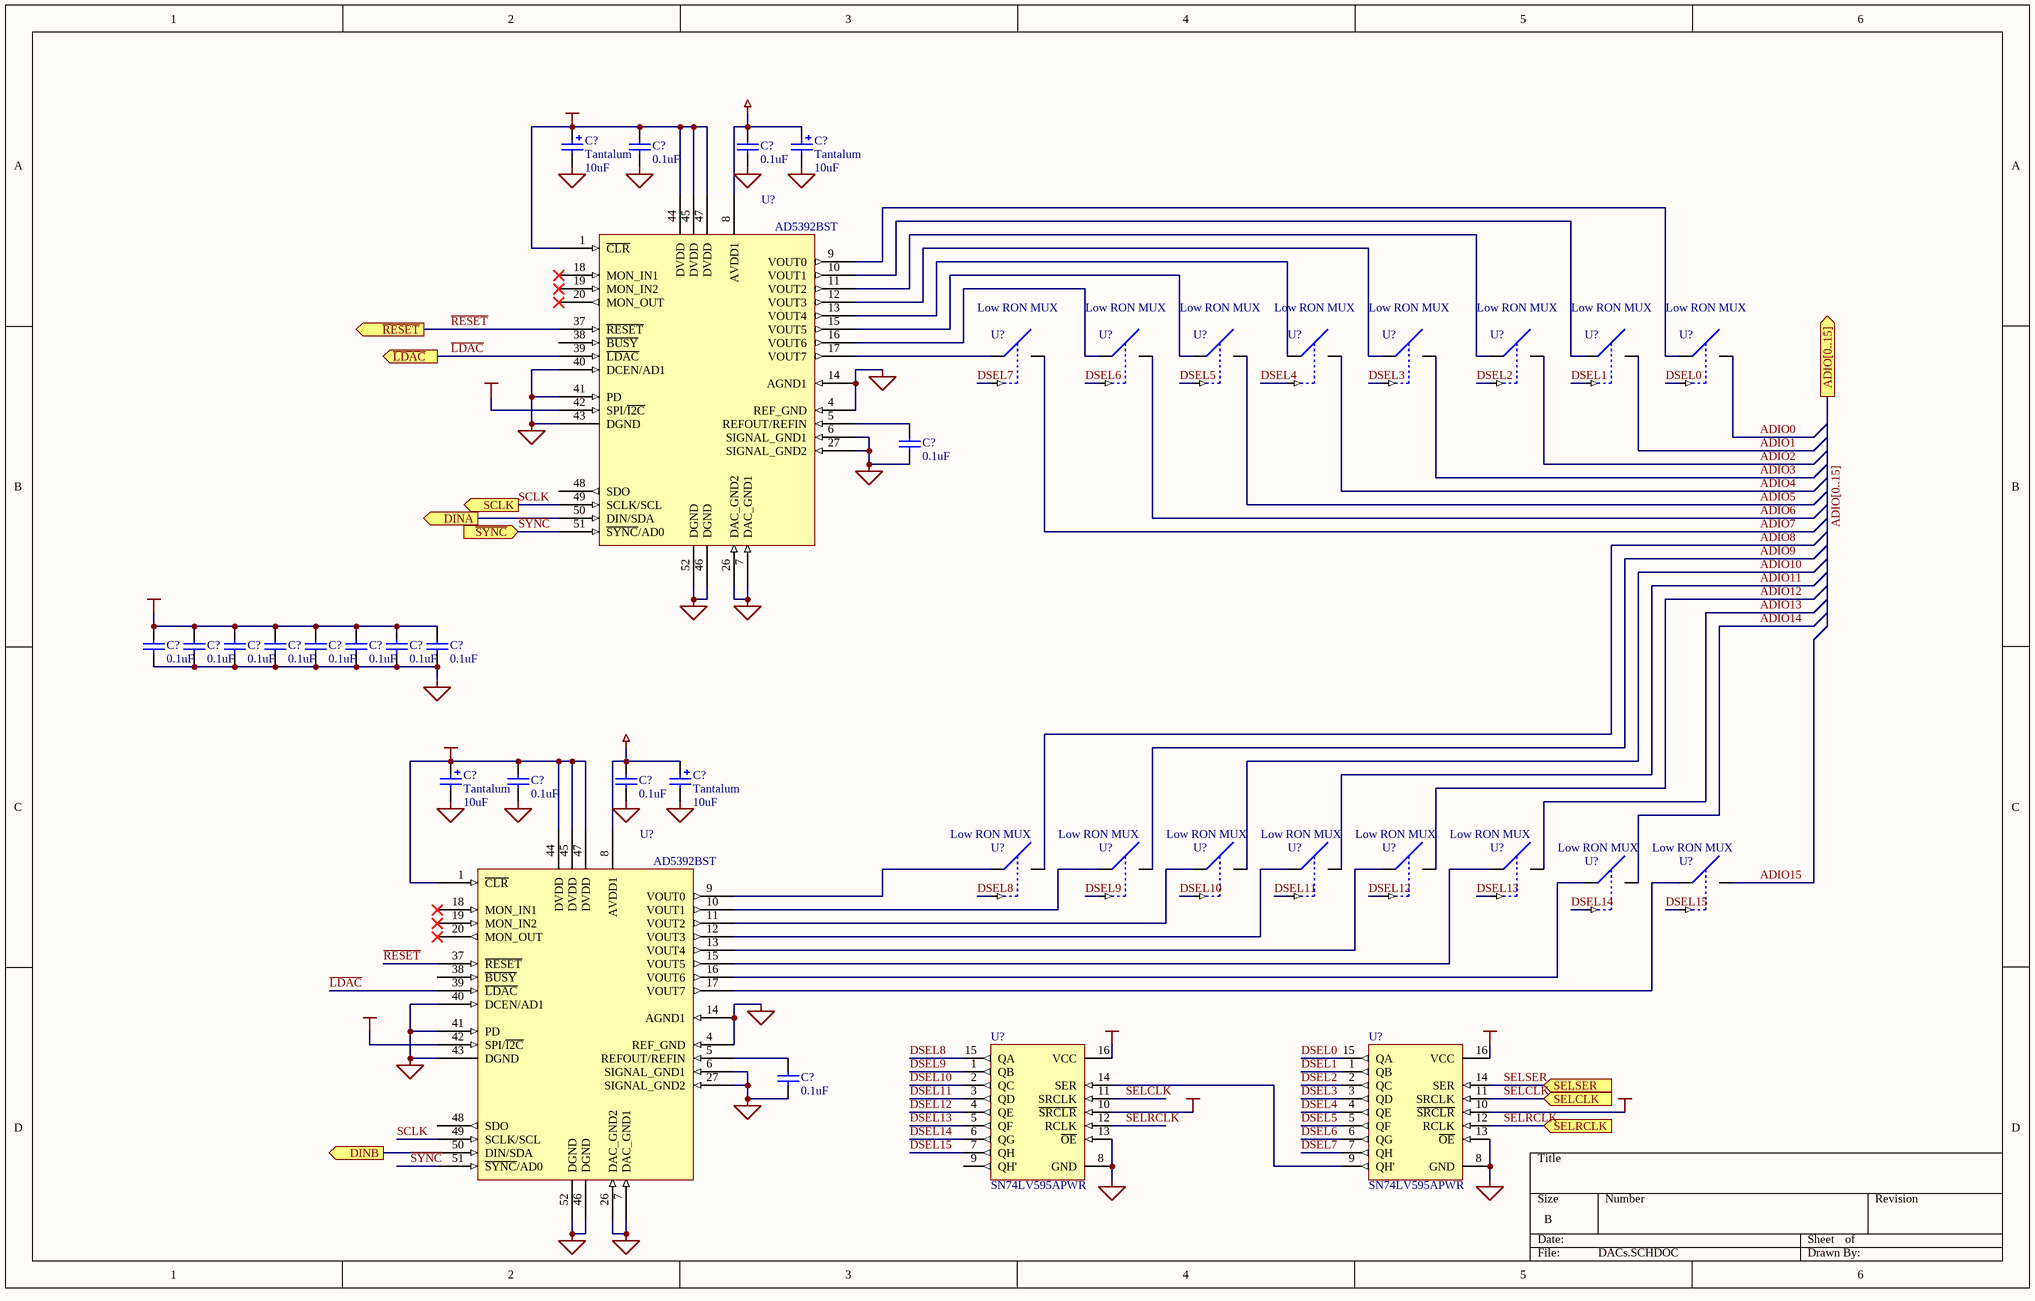
[diagram p3: DACs.SCHDOC]

### Parts
(Parts that share a designator on the sheet are numbered #1, #2 ... from top to bottom, then left to right.)
C?#25  Tantalum  value 10uF  [TC3528-1411]
C?#26  Tantalum  value 10uF  [TC3528-1411]
C?#27  value 0.1uF  [CC1608-0603]  (hidden comment: Cap)
C?#28  value 0.1uF  [CC1608-0603]  (hidden comment: Cap)
C?#29  value 0.1uF  [CC1608-0603]  (hidden comment: Cap)
C?#30  value 0.1uF  [CC1608-0603]  (hidden comment: Cap)
C?#31  value 0.1uF  [CC1608-0603]  (hidden comment: Cap)
C?#32  value 0.1uF  [CC1608-0603]  (hidden comment: Cap)
C?#33  value 0.1uF  [CC1608-0603]  (hidden comment: Cap)
C?#34  value 0.1uF  [CC1608-0603]  (hidden comment: Cap)
C?#35  value 0.1uF  [CC1608-0603]  (hidden comment: Cap)
C?#36  value 0.1uF  [CC1608-0603]  (hidden comment: Cap)
C?#37  value 0.1uF  [CC1608-0603]  (hidden comment: Cap)
C?#38  Tantalum  value 10uF  [TC3528-1411]
C?#39  Tantalum  value 10uF  [TC3528-1411]
C?#40  value 0.1uF  [CC1608-0603]  (hidden comment: Cap)
C?#41  value 0.1uF  [CC1608-0603]  (hidden comment: Cap)
C?#42  value 0.1uF  [CC1608-0603]  (hidden comment: Cap)
U?#1  Low RON MUX  [AD RM-8]
U?#2  Low RON MUX  [AD RM-8]
U?#3  Low RON MUX  [AD RM-8]
U?#4  Low RON MUX  [AD RM-8]
U?#5  Low RON MUX  [AD RM-8]
U?#6  Low RON MUX  [AD RM-8]
U?#7  Low RON MUX  [AD RM-8]
U?#8  Low RON MUX  [AD RM-8]
U?#9  AD5392BST  [QFP10x10-G52/Y1.6N]
U?#10  Low RON MUX  [AD RM-8]
U?#11  Low RON MUX  [AD RM-8]
U?#12  Low RON MUX  [AD RM-8]
U?#13  Low RON MUX  [AD RM-8]
U?#14  Low RON MUX  [AD RM-8]
U?#15  Low RON MUX  [AD RM-8]
U?#16  Low RON MUX  [AD RM-8]
U?#17  Low RON MUX  [AD RM-8]
U?#18  AD5392BST  [QFP10x10-G52/Y1.6N]
U?#19  SN74LV595APWR  [SSO-G16/X.4]
U?#20  SN74LV595APWR  [SSO-G16/X.4]

### Ports
ADIO[0..15] (out), DINA (out), DINB (out), SCLK (out), SELCLK (in), SELRCLK (in), SELSER (in), ~{LDAC} (out), ~{RESET} (out), ~{SYNC} (in)

### Nets
+5VCC: C?#30.2 C?#31.2 C?#32.2 C?#33.2 C?#34.2 C?#35.2 C?#36.2 C?#37.2 U?#19.10(~{SRCLR}) U?#19.16(VCC) U?#20.10(~{SRCLR}) U?#20.16(VCC)
AVDD: C?#26.1 C?#28.2 C?#39.1 C?#41.2 U?#9.8(AVDD1) U?#18.8(AVDD1)
GND: C?#25.2 C?#26.2 C?#27.1 C?#28.1 C?#29.1 C?#30.1 C?#31.1 C?#32.1 C?#33.1 C?#34.1 C?#35.1 C?#36.1 C?#37.1 C?#38.2 C?#39.2 C?#40.1 C?#41.1 C?#42.1 U?#1.7(GND) U?#2.7(GND) U?#3.7(GND) U?#4.7(GND) U?#5.7(GND) U?#6.7(GND) U?#7.7(GND) U?#8.7(GND) U?#9.4(REF_GND) U?#9.6(SIGNAL_GND1) U?#9.7(DAC_GND1) U?#9.14(AGND1) U?#9.26(DAC_GND2) U?#9.27(SIGNAL_GND2) U?#9.40(DCEN/AD1) U?#9.41(PD) U?#9.43(DGND) U?#9.46(DGND) U?#9.52(DGND) U?#10.7(GND) U?#11.7(GND) U?#12.7(GND) U?#13.7(GND) U?#14.7(GND) U?#15.7(GND) U?#16.7(GND) U?#17.7(GND) U?#18.4(REF_GND) U?#18.6(SIGNAL_GND1) U?#18.7(DAC_GND1) U?#18.14(AGND1) U?#18.26(DAC_GND2) U?#18.27(SIGNAL_GND2) U?#18.40(DCEN/AD1) U?#18.41(PD) U?#18.43(DGND) U?#18.46(DGND) U?#18.52(DGND) U?#19.8(GND) U?#19.13(~{OE}) U?#20.8(GND) U?#20.13(~{OE})
VCC: C?#25.1 C?#27.2 C?#38.1 C?#40.2 U?#9.1(~{CLR}) U?#9.42(SPI/~{I2C}) U?#9.44(DVDD) U?#9.45(DVDD) U?#9.47(DVDD) U?#18.1(~{CLR}) U?#18.42(SPI/~{I2C}) U?#18.44(DVDD) U?#18.45(DVDD) U?#18.47(DVDD)
VDD: U?#1.4(VDD) U?#2.4(VDD) U?#3.4(VDD) U?#4.4(VDD) U?#5.4(VDD) U?#6.4(VDD) U?#7.4(VDD) U?#8.4(VDD) U?#10.4(VDD) U?#11.4(VDD) U?#12.4(VDD) U?#13.4(VDD) U?#14.4(VDD) U?#15.4(VDD) U?#16.4(VDD) U?#17.4(VDD)
ADIO0: U?#8.8(S)
ADIO1: U?#7.8(S)
ADIO2: U?#6.8(S)
ADIO3: U?#5.8(S)
ADIO4: U?#4.8(S)
ADIO5: U?#3.8(S)
ADIO6: U?#2.8(S)
ADIO7: U?#1.8(S)
ADIO8: U?#10.8(S)
ADIO9: U?#11.8(S)
ADIO10: U?#12.8(S)
ADIO11: U?#13.8(S)
ADIO12: U?#14.8(S)
ADIO13: U?#15.8(S)
ADIO14: U?#16.8(S)
ADIO15: U?#17.8(S)
DSEL0: U?#8.6(IN) U?#20.15(QA)
DSEL1: U?#7.6(IN) U?#20.1(QB)
DSEL2: U?#6.6(IN) U?#20.2(QC)
DSEL3: U?#5.6(IN) U?#20.3(QD)
DSEL4: U?#4.6(IN) U?#20.4(QE)
DSEL5: U?#3.6(IN) U?#20.5(QF)
DSEL6: U?#2.6(IN) U?#20.6(QG)
DSEL7: U?#1.6(IN) U?#20.7(QH)
DSEL8: U?#10.6(IN) U?#19.15(QA)
DSEL9: U?#11.6(IN) U?#19.1(QB)
DSEL10: U?#12.6(IN) U?#19.2(QC)
DSEL11: U?#13.6(IN) U?#19.3(QD)
DSEL12: U?#14.6(IN) U?#19.4(QE)
DSEL13: U?#15.6(IN) U?#19.5(QF)
DSEL14: U?#16.6(IN) U?#19.6(QG)
DSEL15: U?#17.6(IN) U?#19.7(QH)
~{LDAC}: U?#9.39(~{LDAC}) U?#18.39(~{LDAC}) ; port ~{LDAC}
~{RESET}: U?#9.37(~{RESET}) U?#18.37(~{RESET}) ; port ~{RESET}
~{SYNC}: U?#9.51(~{SYNC}/AD0) U?#18.51(~{SYNC}/AD0) ; port ~{SYNC}
SCLK: U?#9.49(SCLK/SCL) U?#18.49(SCLK/SCL) ; port SCLK
SELCLK: U?#19.11(SRCLK) U?#20.11(SRCLK) ; port SELCLK
SELRCLK: U?#19.12(RCLK) U?#20.12(RCLK) ; port SELRCLK
SELSER: U?#20.14(SER) ; port SELSER
Net*?#2_30: U?#18.50(DIN/SDA) ; port DINB
Net*?#2_34: U?#9.50(DIN/SDA) ; port DINA
NetC?#29_2: C?#29.2 U?#9.5(REFOUT/REFIN)
NetC?#42_2: C?#42.2 U?#18.5(REFOUT/REFIN)
NetU?#1_1: U?#1.1(D) U?#9.17(VOUT7)
NetU?#2_1: U?#2.1(D) U?#9.16(VOUT6)
NetU?#3_1: U?#3.1(D) U?#9.15(VOUT5)
NetU?#4_1: U?#4.1(D) U?#9.13(VOUT4)
NetU?#5_1: U?#5.1(D) U?#9.12(VOUT3)
NetU?#6_1: U?#6.1(D) U?#9.11(VOUT2)
NetU?#7_1: U?#7.1(D) U?#9.10(VOUT1)
NetU?#8_1: U?#8.1(D) U?#9.9(VOUT0)
NetU?#10_1: U?#10.1(D) U?#18.9(VOUT0)
NetU?#11_1: U?#11.1(D) U?#18.10(VOUT1)
NetU?#12_1: U?#12.1(D) U?#18.11(VOUT2)
NetU?#13_1: U?#13.1(D) U?#18.12(VOUT3)
NetU?#14_1: U?#14.1(D) U?#18.13(VOUT4)
NetU?#15_1: U?#15.1(D) U?#18.15(VOUT5)
NetU?#16_1: U?#16.1(D) U?#18.16(VOUT6)
NetU?#17_1: U?#17.1(D) U?#18.17(VOUT7)
NetU?#19_14: U?#19.14(SER) U?#20.9(QH')

Not connected (* = marked no-connect by the designer): U?#9 18(MON_IN1)* 19(MON_IN2)* 20(MON_OUT)* 38(~{BUSY}) 48(SDO); U?#18 18(MON_IN1)* 19(MON_IN2)* 20(MON_OUT)* 38(~{BUSY}) 48(SDO); U?#19 9(QH')

### Buses and harness runs
bus ADIO[0..15] = port ADIO[0..15]

### Library data of the parts
C?#25 C?#26 C?#38 C?#39 = Cap Pol1: as C16 on sheet ADCs; Published: 8-Jun-2000; Revision: July-2002: Re-released for DXP Platform.; Publisher: Altium Limited; Class II: Capacitor
C?#27-C?#37 C?#40-C?#42 = Cap: as C?#1 on sheet FPGA; Published: 8-Jun-2000; Revision: July-2002: Re-released for DXP Platform.; Publisher: Altium Limited; Class II: Capacitor
U?#1-U?#8 U?#10-U?#17 = ADG802: Low Ron single-supply SPST NO mux.
U?#9 U?#18 = AD5392BST: 8-chan 14-BIT DAC
U?#19 U?#20 = SN74LV595APWR: 8-bit shift register with 3-state output

## Sheet fiber.SCHDOC
size B
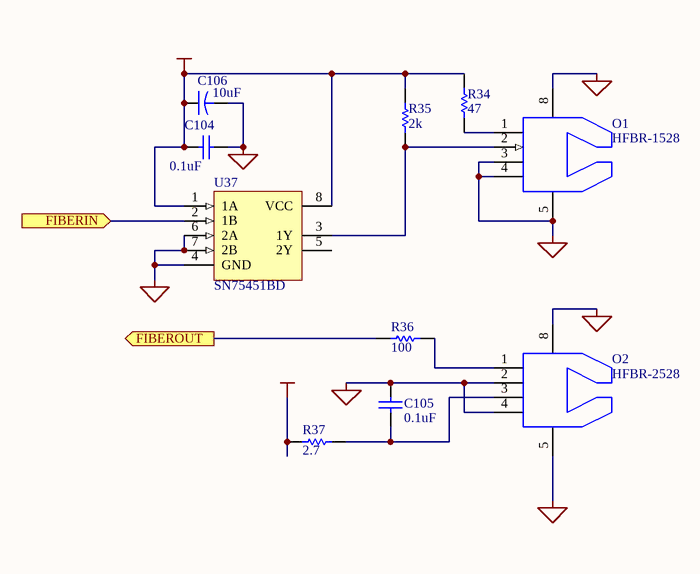
[diagram p4: fiber.SCHDOC]

### Parts
(Parts that share a designator on the sheet are numbered #1, #2 ... from top to bottom, then left to right.)
C104  value 0.1uF  [CC1608-0603]  (hidden comment: Cap)
C105  value 0.1uF  [CC1608-0603]  (hidden comment: Cap)
C106  value 10uF  [TC3528-1411]
O1#1  HFBR-1528  [HPVL]
O2  HFBR-2528  [HPVL]
R34#1  value 47  [R2012-0805]  (hidden comment: Res1)
R35  value 2k  [R2012-0805]  (hidden comment: Res1)
R36  value 100  [R2012-0805]  (hidden comment: Res1)
R37  value 2.7  [R2012-0805]  (hidden comment: Res1)
U37  SN75451BD  [SO-G8/E2.5]

### Ports
FIBERIN (in), FIBEROUT (out)

### Nets
+5VCC: C104.1 C106.1 R34#1.2 R35.2 R37.1 U37.1(1A) U37.8(VCC)
GND: C104.2 C105.2 C106.2 O1#1.3 O1#1.4 O1#1.5 O1#1.8 O2.2 O2.4 O2.5 O2.8 U37.4(GND) U37.6(2A) U37.7(2B)
Net*?#2_27: R36.1 ; port FIBEROUT
Net*?#2_32: U37.2(1B) ; port FIBERIN
NetC105_1: C105.1 O2.3 R37.2
NetO1#1_1: O1#1.1 R34#1.1
NetO1#1_2: O1#1.2 R35.1 U37.3(1Y)
NetO2_1: O2.1 R36.2

Not connected (* = marked no-connect by the designer): U37 5(2Y)

### Library data of the parts
C104 C105 = Cap: as C?#1 on sheet FPGA; Published: 8-Jun-2000; Revision: July-2002: Re-released for DXP Platform.; Publisher: Altium Limited; Class II: Capacitor
C106 = Cap2: Capacitor; Manufacturer: Generic Components; Class I: Passive; Published: 23-Sep-2002; Publisher: Altium Limited; Class II: Capacitor
O1#1 = HFBR-1528: Low-cost fiber transmitter
O2 = HFBR-2528: Low-cost fiber receiver
R34#1 R35-R37 = Res1: as R?#1 on sheet FPGA; Published: 8-Jun-2000; Revision: July-2002: Re-released for DXP Platform.; Publisher: Altium Limited; Class II: Resistor
U37 = SN75451BD: Dual Peripheral Driver; Manufacturer: Texas Instruments; Package Information: Latest Revision: Jan-1998; Class I: Interface; Published: 15-May-2002; Datasheet: 1991 Interface Circuits Data Book (May-1990); Package Reference: D008; Publisher: Altium Limited; Class II: Peripheral Driver

## Sheet boot.SCHDOC
size B
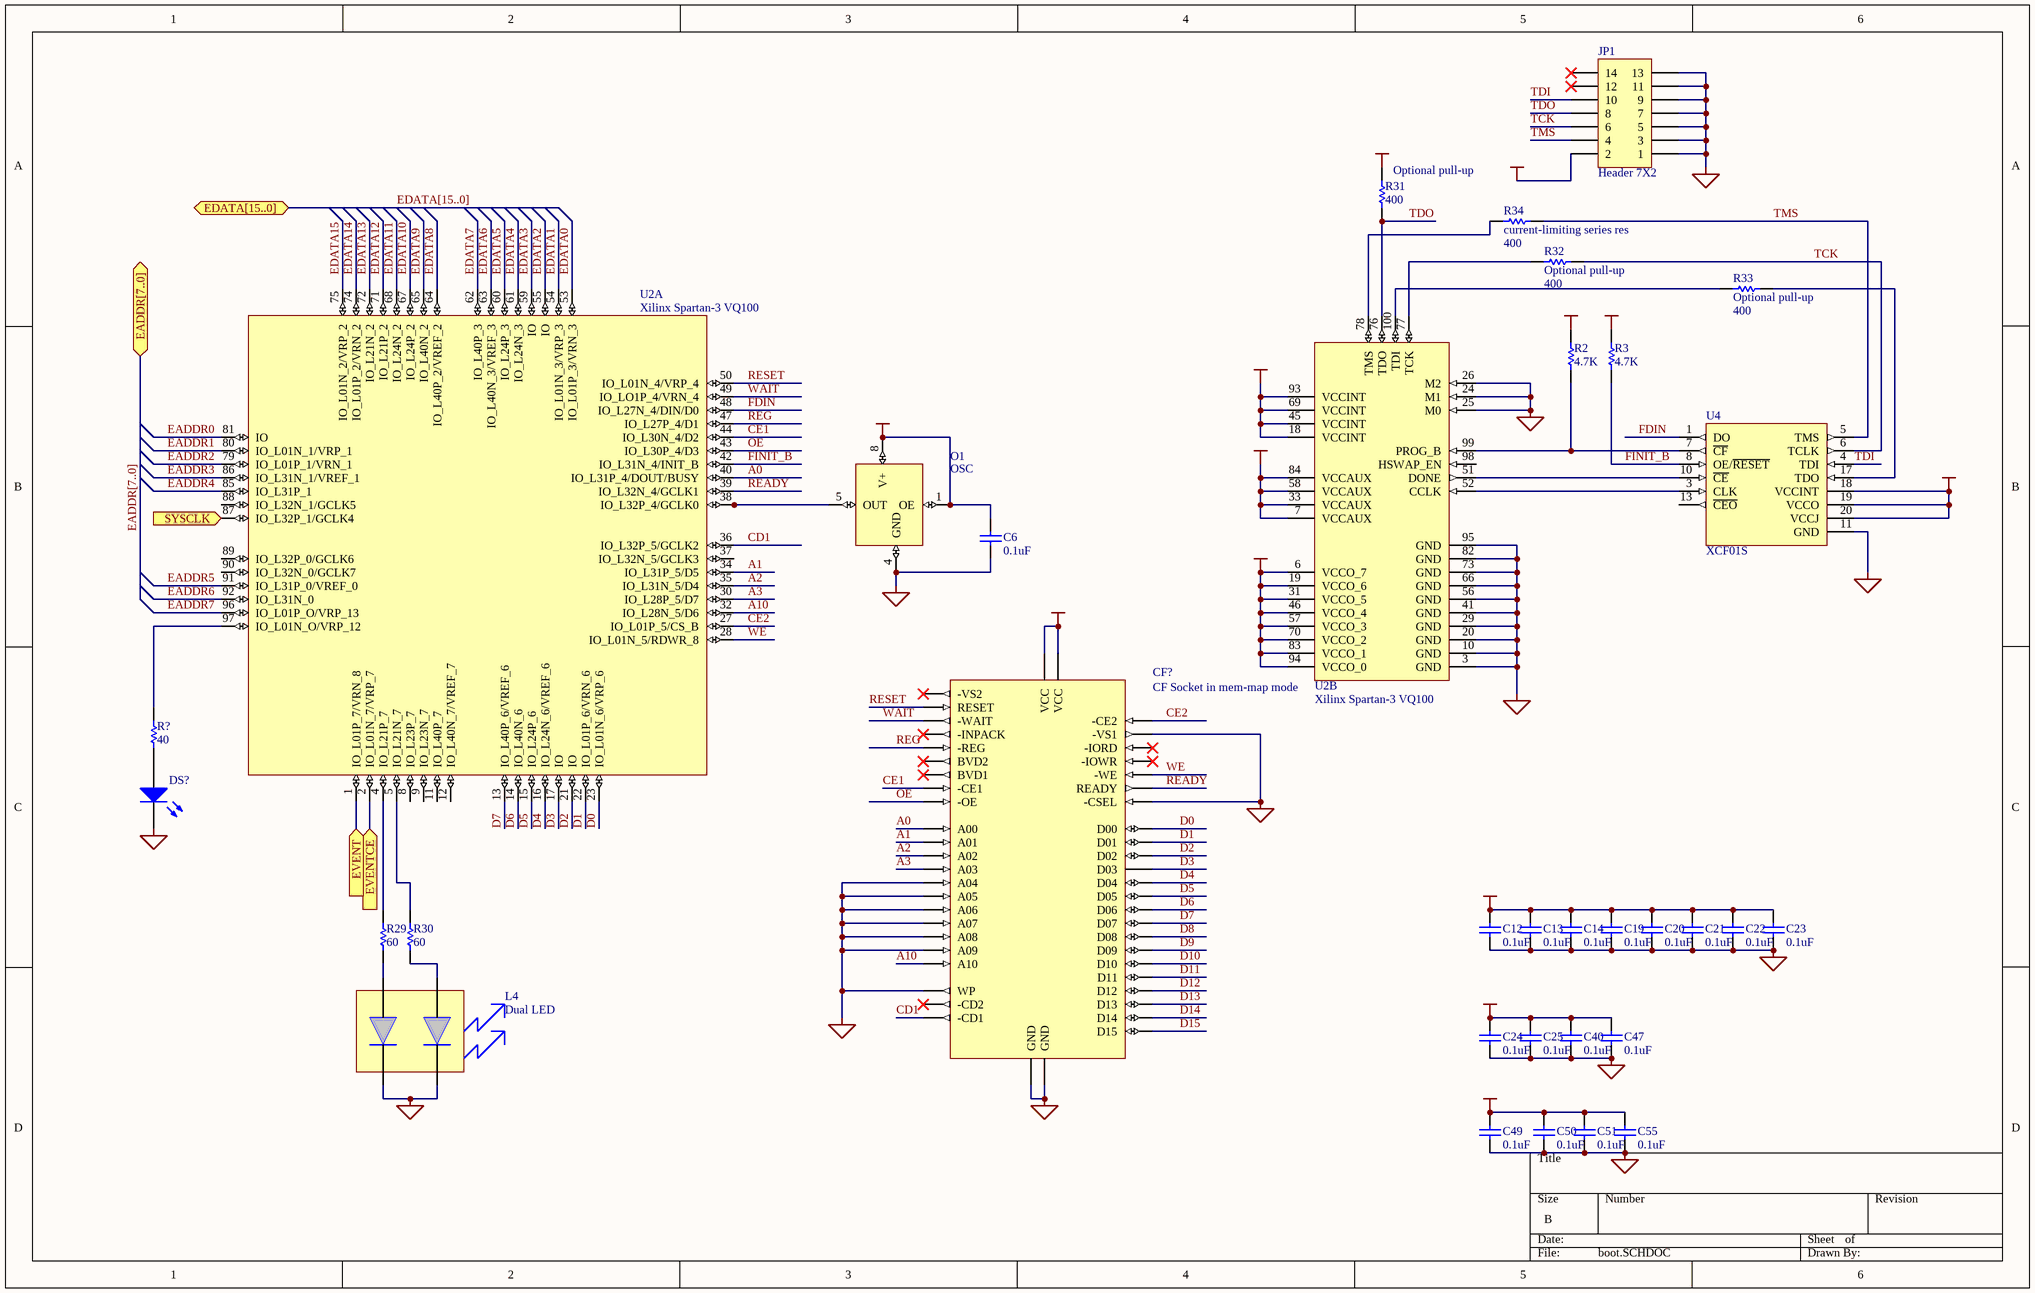
[diagram p5: boot.SCHDOC]

### Parts
(Parts that share a designator on the sheet are numbered #1, #2 ... from top to bottom, then left to right.)
C6#2  value 0.1uF  [CC1608-0603]  (hidden comment: Cap)
C12#2  value 0.1uF  [CC1608-0603]  (hidden comment: Cap)
C13#2  value 0.1uF  [CC1608-0603]  (hidden comment: Cap)
C14#2  value 0.1uF  [CC1608-0603]  (hidden comment: Cap)
C19  value 0.1uF  [CC1608-0603]  (hidden comment: Cap)
C20  value 0.1uF  [CC1608-0603]  (hidden comment: Cap)
C21  value 0.1uF  [CC1608-0603]  (hidden comment: Cap)
C22  value 0.1uF  [CC1608-0603]  (hidden comment: Cap)
C23  value 0.1uF  [CC1608-0603]  (hidden comment: Cap)
C24  value 0.1uF  [CC1608-0603]  (hidden comment: Cap)
C25  value 0.1uF  [CC1608-0603]  (hidden comment: Cap)
C40#2  value 0.1uF  [CC1608-0603]  (hidden comment: Cap)
C47  value 0.1uF  [CC1608-0603]  (hidden comment: Cap)
C49  value 0.1uF  [CC1608-0603]  (hidden comment: Cap)
C50  value 0.1uF  [CC1608-0603]  (hidden comment: Cap)
C51  value 0.1uF  [CC1608-0603]  (hidden comment: Cap)
C55  value 0.1uF  [CC1608-0603]  (hidden comment: Cap)
CF?  CF Socket in mem-map mode
DS?  LED0  [T-1_LED]  (value not drawn)
JP1  Header 7X2  [HDR2X7]
L4  Dual LED  [LUMEX DUAL RT-ANG LED]
O1#2  OSC  [SG636PCE]
R2  value 4.7K  [CC1608-0603]  (hidden comment: Res1)
R3  value 4.7K  [CC1608-0603]  (hidden comment: Res1)
R29  value 60  [R2012-0805]  (hidden comment: Res1)
R30  value 60  [R2012-0805]  (hidden comment: Res1)
R31  Optional pull-up  value 400  [CC1608-0603]
R32  Optional pull-up  value 400  [CC1608-0603]
R33  Optional pull-up  value 400  [CC1608-0603]
R34#2  current-limiting series res  value 400  [CC1608-0603]
R?#14  value 40  [CC1608-0603]  (hidden comment: Res1)
U2#2  Xilinx Spartan-3 VQ100  [F-QFP14X14-G100/N]  (parts A,B of 2)
U4#2  XCF01S  [TSSO6x6-G20/X.3]

### Ports
EADDR[7..0] (bidir), EDATA[15..0] (bidir), EVENT (in), EVENTCE (in), SYSCLK (in)

### Nets
+1.2VCC: C24.1 C25.1 C40#2.1 C47.1 U2#2.18(VCCINT) U2#2.45(VCCINT) U2#2.69(VCCINT) U2#2.93(VCCINT)
+2.5VCC: C49.1 C50.1 C51.1 C55.1 U2#2.7(VCCAUX) U2#2.33(VCCAUX) U2#2.58(VCCAUX) U2#2.84(VCCAUX)
GND: C6#2.2 C12#2.2 C13#2.2 C14#2.2 C19.2 C20.2 C21.2 C22.2 C23.2 C24.2 C25.2 C40#2.2 C47.2 C49.2 C50.2 C51.2 C55.2 CF?.1(GND) CF?.10(A09) CF?.11(A08) CF?.12(A07) CF?.14(A06) CF?.15(A05) CF?.16(A04) CF?.24(WP) CF?.33(-VS1) CF?.39(-CSEL) CF?.50(GND) DS?.2(K) JP1.1 JP1.3 JP1.5 JP1.7 JP1.9 JP1.11 JP1.13 L4.2 L4.4(C2) O1#2.4(GND) U2#2.3(GND) U2#2.10(GND) U2#2.20(GND) U2#2.24(M1) U2#2.25(M0) U2#2.26(M2) U2#2.29(GND) U2#2.41(GND) U2#2.56(GND) U2#2.66(GND) U2#2.73(GND) U2#2.82(GND) U2#2.95(GND) U4#2.11(GND)
VCC: C6#2.1 C12#2.1 C13#2.1 C14#2.1 C19.1 C20.1 C21.1 C22.1 C23.1 CF?.13(VCC) CF?.38(VCC) JP1.2 O1#2.1(OE) O1#2.8(V+) R2.2 R3.2 R31.2 U2#2.6(VCCO_7) U2#2.19(VCCO_6) U2#2.31(VCCO_5) U2#2.46(VCCO_4) U2#2.57(VCCO_3) U2#2.70(VCCO_2) U2#2.83(VCCO_1) U2#2.94(VCCO_0) U4#2.18(VCCINT) U4#2.19(VCCO) U4#2.20(VCCJ)
A0: CF?.20(A00) U2#2.40(IO_L31P_4/DOUT/BUSY)
A1: CF?.19(A01) U2#2.34(IO_L31P_5/D5)
A2: CF?.18(A02) U2#2.35(IO_L31N_5/D4)
A3: CF?.17(A03) U2#2.30(IO_L28P_5/D7)
A10: CF?.8(A10) U2#2.32(IO_L28N_5/D6)
CD1: CF?.26(-CD1) U2#2.36(IO_L32P_5/GCLK2)
CE1: CF?.7(-CE1) U2#2.44(IO_L30N_4/D2)
CE2: CF?.32(-CE2) U2#2.27(IO_L01P_5/CS_B)
D0: CF?.21(D00) U2#2.23(IO_L01N_6/VRP_6)
D1: CF?.22(D01) U2#2.22(IO_L01P_6/VRN_6)
D2: CF?.23(D02) U2#2.21(IO)
D3: CF?.2(D03) U2#2.17(IO)
D4: CF?.3(D04) U2#2.16(IO_L24N_6/VREF_6)
D5: CF?.4(D05) U2#2.15(IO_L24P_6)
D6: CF?.5(D06) U2#2.14(IO_L40N_6)
D7: CF?.6(D07) U2#2.13(IO_L40P_6/VREF_6)
D8: CF?.47(D08)
D9: CF?.48(D09)
D10: CF?.49(D10)
D11: CF?.27(D11)
D12: CF?.28(D12)
D13: CF?.29(D13)
D14: CF?.30(D14)
D15: CF?.31(D15)
EADDR0: U2#2.81(IO)
EADDR1: U2#2.80(IO_L01N_1/VRP_1)
EADDR2: U2#2.79(IO_L01P_1/VRN_1)
EADDR3: U2#2.86(IO_L31N_1/VREF_1)
EADDR4: U2#2.85(IO_L31P_1)
EADDR5: U2#2.91(IO_L31P_0/VREF_0)
EADDR6: U2#2.92(IO_L31N_0)
EADDR7: U2#2.96(IO_L01P_O/VRP_13)
EDATA0: U2#2.53(IO_L01P_3/VRN_3)
EDATA1: U2#2.54(IO_L01N_3/VRP_3)
EDATA2: U2#2.55(IO)
EDATA3: U2#2.59(IO)
EDATA4: U2#2.61(IO_L24N_3)
EDATA5: U2#2.60(IO_L24P_3)
EDATA6: U2#2.63(IO_L40N_3/VREF_3)
EDATA7: U2#2.62(IO_L40P_3)
EDATA8: U2#2.64(IO_L40P_2/VREF_2)
EDATA9: U2#2.65(IO_L40N_2)
EDATA10: U2#2.67(IO_L24P_2)
EDATA11: U2#2.68(IO_L24N_2)
EDATA12: U2#2.71(IO_L21P_2)
EDATA13: U2#2.72(IO_L21N_2)
EDATA14: U2#2.74(IO_L01P_2/VRN_2)
EDATA15: U2#2.75(IO_L01N_2/VRP_2)
FDIN: U2#2.48(IO_L27N_4/DIN/D0) U4#2.1(DO)
FINIT_B: R3.1 U2#2.42(IO_L31N_4/INIT_B) U4#2.8(OE/~{RESET})
OE: CF?.9(-OE) U2#2.43(IO_L30P_4/D3)
READY: CF?.37(READY) U2#2.39(IO_L32N_4/GCLK1)
REG: CF?.44(-REG) U2#2.47(IO_L27P_4/D1)
RESET: CF?.41(RESET) U2#2.50(IO_L01N_4/VRP_4)
SYSCLK: U2#2.87(IO_L32P_1/GCLK4) ; port SYSCLK
TCK: JP1.6 R32.1 U4#2.6(TCLK)
TDI: JP1.10 U4#2.4(TDI)
TDO: JP1.8 R31.1 U2#2.76(TDO)
TMS: JP1.4 R34#2.1 U4#2.5(TMS)
WAIT: CF?.42(-WAIT) U2#2.49(IO_LO1P_4/VRN_4)
WE: CF?.36(-WE) U2#2.28(IO_L01N_5/RDWR_8)
NetDS?_1: DS?.1(A) R?#14.1
NetL4_1: L4.1(A1) R29.2
NetL4_3: L4.3(A2) R30.1
NetO1#2_5: O1#2.5(OUT) U2#2.38(IO_L32P_4/GCLK0)
NetR2_1: R2.1 U2#2.99(PROG_B) U4#2.7(~{CF})
NetR29_1: R29.1 U2#2.4(IO_L21P_7)
NetR30_2: R30.2 U2#2.5(IO_L21N_7)
NetR32_2: R32.2 U2#2.77(TCK)
NetR33_1: R33.1 U4#2.17(TDO)
NetR33_2: R33.2 U2#2.100(TDI)
NetR34#2_2: R34#2.2 U2#2.78(TMS)
NetR?#14_2: R?#14.2 U2#2.97(IO_L01N_O/VRP_12)
NetU2#2_1: U2#2.1(IO_L01P_7/VRN_8) ; port EVENT
NetU2#2_2: U2#2.2(IO_L01N_7/VRP_7) ; port EVENTCE
NetU2#2_51: U2#2.51(DONE) U4#2.10(~{CE})
NetU2#2_52: U2#2.52(CCLK) U4#2.3(CLK)

Not connected (* = marked no-connect by the designer): CF? 25(-CD2)* 34(-IORD)* 35(-IOWR)* 40(-VS2)* 43(-INPACK)* 45(BVD2)* 46(BVD1)*; JP1 12* 14*; U2#2 8(IO_L23P_7) 9(IO_L23N_7) 11(IO_L40P_7) 12(IO_L40N_7/VREF_7) 37(IO_L32N_5/GCLK3) 88(IO_L32N_1/GCLK5) 89(IO_L32P_0/GCLK6) 90(IO_L32N_0/GCLK7) 98(HSWAP_EN); U4#2 13(~{CEO})

### Buses and harness runs
bus EADDR[7..0] = port EADDR[7..0]
bus EDATA[15..0] = port EDATA[15..0]

### Library data of the parts
C6#2 C12#2 C13#2 C14#2 C19-C25 C40#2 C47 C49-C51 C55 = Cap: as C?#1 on sheet FPGA; Published: 8-Jun-2000; Revision: July-2002: Re-released for DXP Platform.; Publisher: Altium Limited; Class II: Capacitor
CF? = CF_MEM: CF socket in memory-mapped mode
DS? = LED0: Typical INFRARED GaAs LED; Manufacturer: Generic Components; Class I: Optoelectronic; Published: 8-Jun-2000; Revision: July-2002: Re-released for DXP Platform.; Publisher: Altium Limited; Class II: LED
JP1 = Header 7X2: Header, 7-Pin, Dual row; Manufacturer: Generic Components; Class I: Connector; Revision: July-2002: Re-released for DXP Platform.; Publisher: Altium Limited
O1#2 = OSC: Epson CMOS/TTL Oscillator
R2 R3 R29-R33 R34#2 R?#14 = Res1: as R?#1 on sheet FPGA; Published: 8-Jun-2000; Revision: July-2002: Re-released for DXP Platform.; Publisher: Altium Limited; Class II: Resistor
U2#2 = XC3S50-VQ100
U4#2 = XCF01S: Xilinx Platform Flash

## Nets that join several sheets
+1.2VCC: FPGA (8 pins), boot (8 pins)
+2.5VCC: FPGA (8 pins), boot (8 pins)
+5VCC: FPGA (8 pins), ADCs (8 pins), DIO (18 pins), DACs (12 pins), fiber (7 pins)
AVDD: ADCs (10 pins), DACs (6 pins)
GND: FPGA (81 pins), ADCs (20 pins), DIO (108 pins), DACs (60 pins), fiber (14 pins), boot (53 pins)
VCC: FPGA (21 pins), ADCs (C14#1.2 C17.1 U5.17), DIO (56 pins), DACs (14 pins), boot (28 pins)
ADIO0: ADCs (U1.3), DACs (U?#8.8)
ADIO1: ADCs (U1.5), DACs (U?#7.8)
ADIO2: ADCs (U1.10), DACs (U?#6.8)
ADIO3: ADCs (U1.12), DACs (U?#5.8)
ADIO4: ADCs (U2#1.3), DACs (U?#4.8)
ADIO5: ADCs (U2#1.5), DACs (U?#3.8)
ADIO6: ADCs (U2#1.10), DACs (U?#2.8)
ADIO7: ADCs (U2#1.12), DACs (U?#1.8)
ADIO8: ADCs (U3.3), DACs (U?#10.8)
ADIO9: ADCs (U3.5), DACs (U?#11.8)
ADIO10: ADCs (U3.10), DACs (U?#12.8)
ADIO11: ADCs (U3.12), DACs (U?#13.8)
ADIO12: ADCs (U4#1.3), DACs (U?#14.8)
ADIO13: ADCs (U4#1.5), DACs (U?#15.8)
ADIO14: ADCs (U4#1.10), DACs (U?#16.8)
ADIO15: ADCs (U4#1.12), DACs (U?#17.8)
~{LDAC}: FPGA (*?#2.36), DACs (U?#9.39 U?#18.39)
Net*?#2_13: FPGA (*?#2.13), DIO (U33.13)
Net*?#2_14: FPGA (*?#2.14), DIO (U31.13)
Net*?#2_21: FPGA (*?#2.21), DIO (U29.14)
Net*?#2_22: FPGA (*?#2.22), DIO (U27.14)
Net*?#2_27: FPGA (*?#2.27), fiber (R36.1)
Net*?#2_30: FPGA (*?#2.30), DACs (U?#18.50)
Net*?#2_32: FPGA (*?#2.32), fiber (U37.2)
Net*?#2_34: FPGA (*?#2.34), DACs (U?#9.50)
Net*?#2_44: FPGA (*?#2.44), ADCs (U5.15)
Net*?#2_47: FPGA (*?#2.47), ADCs (U5.16)
Net*?#2_49: FPGA (*?#2.49), ADCs (U5.20)
Net*?#2_50: FPGA (*?#2.50), ADCs (U5.19)
~{RESET}: FPGA (*?#2.35), DACs (U?#9.37 U?#18.37)
RCLK: FPGA (*?#2.15), DIO (U27.12 U28.12 U29.12 U30.12)
~{SYNC}: FPGA (*?#2.43), DACs (U?#9.51 U?#18.51)
SCLK: FPGA (*?#2.37), DACs (U?#9.49 U?#18.49)
SCLK: FPGA (*?#2.23), DIO (8 pins)
SELCLK: FPGA (*?#2.39), DACs (U?#19.11 U?#20.11)
SELRCLK: FPGA (*?#2.38), DACs (U?#19.12 U?#20.12)
SELSER: FPGA (*?#2.40), DACs (U?#20.14)
SHLD: FPGA (*?#2.28), DIO (U31.15 U32.15 U33.15 U34.15)
SYSCLK: FPGA (CONN?.60), boot (U2#2.87)